# EAGLE board oresat-c3 (EAGLE 9.6.2), part 1 of 2
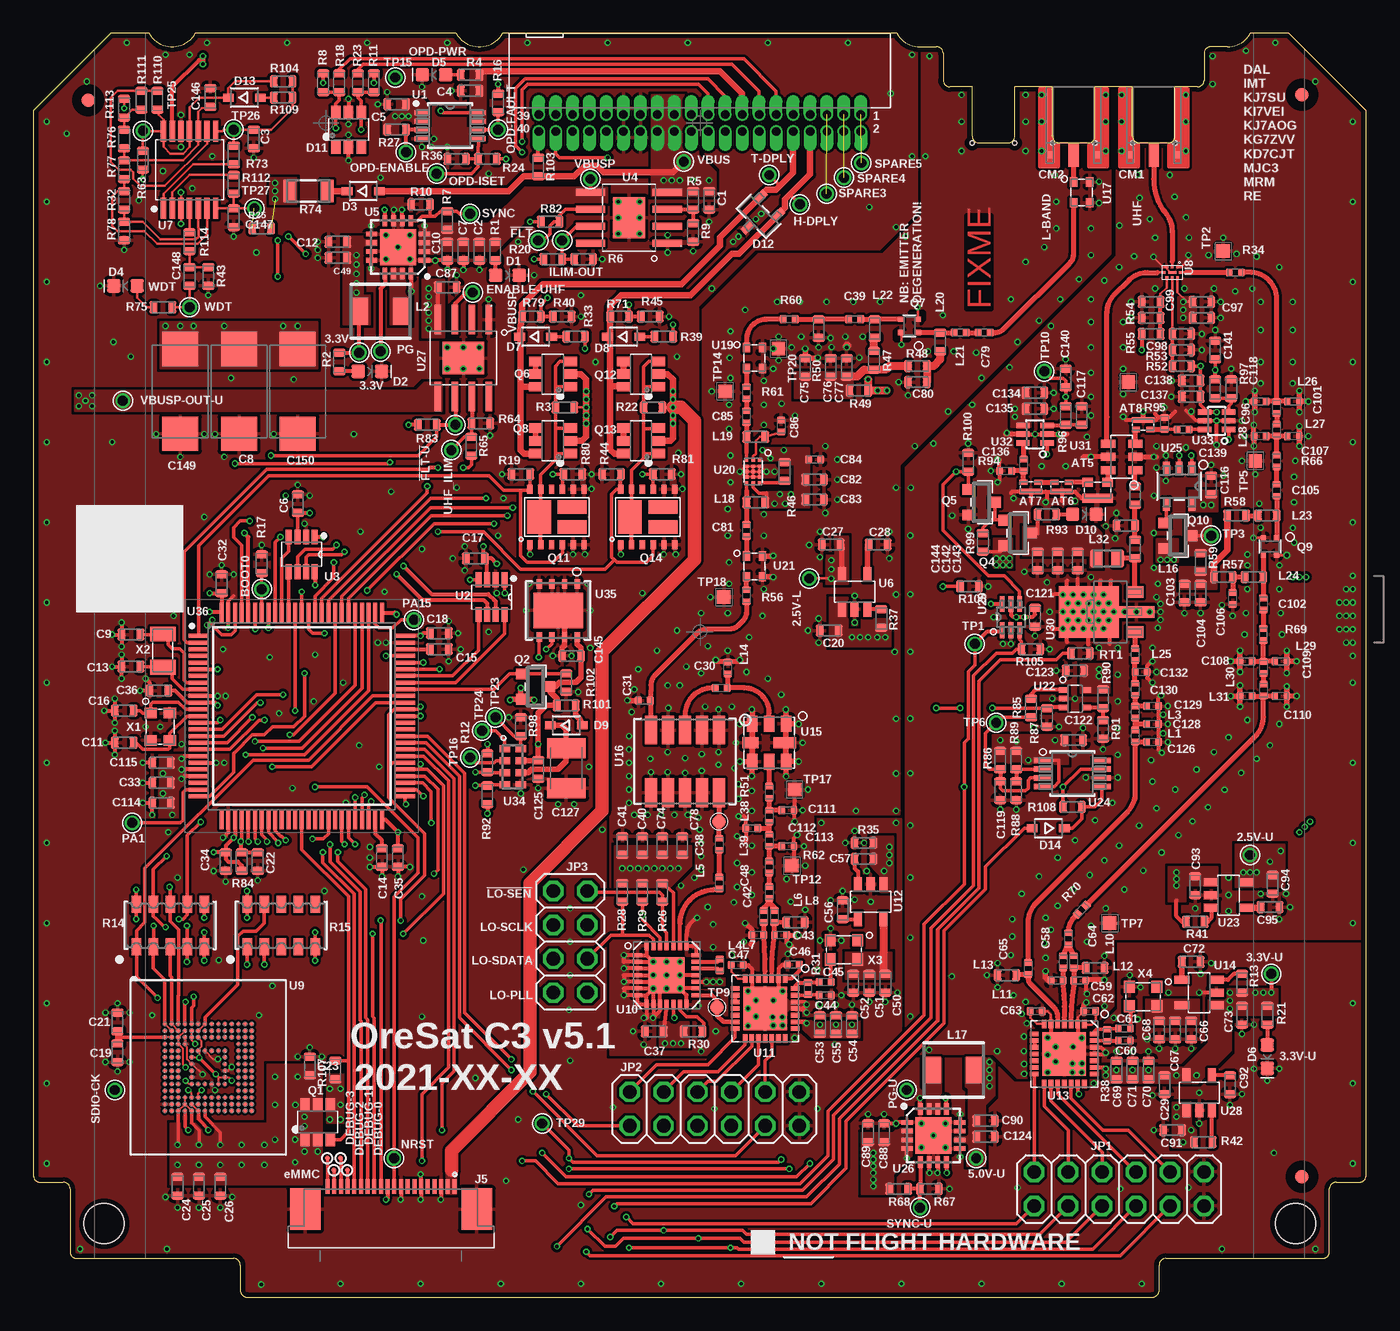
[diagram p9: board, top side]
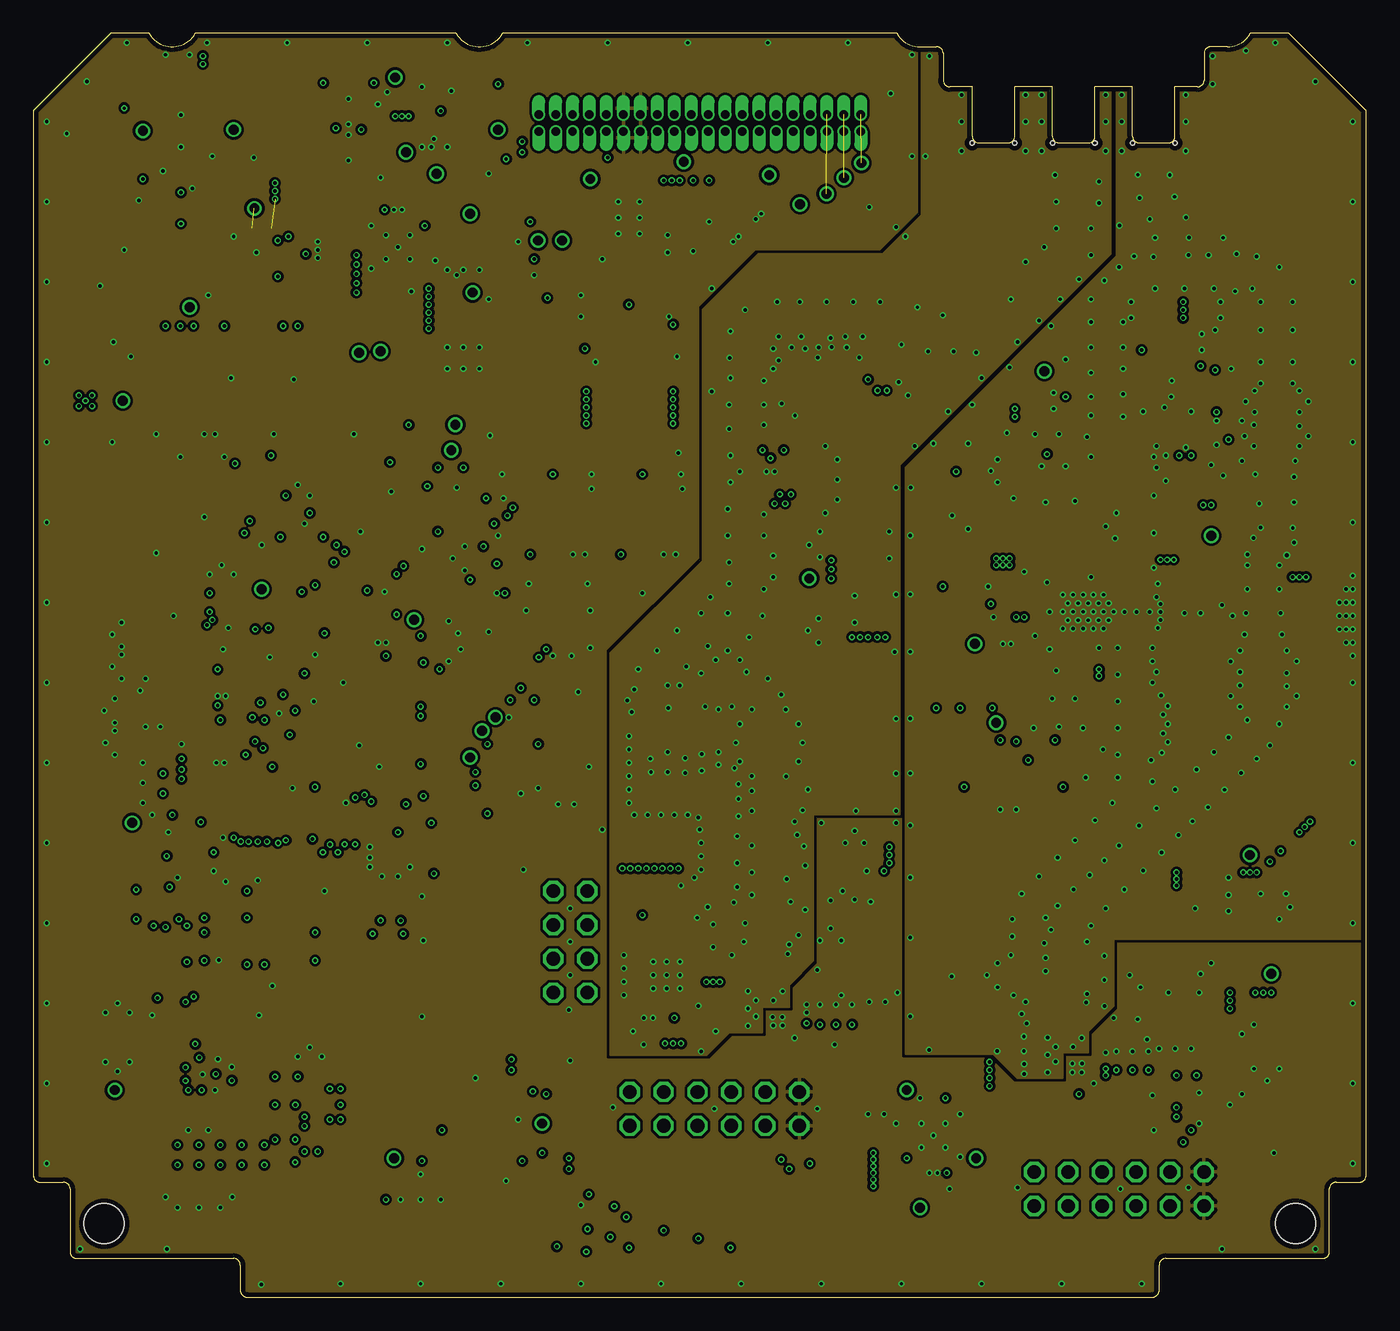
[diagram p10: board, inner layer GND]
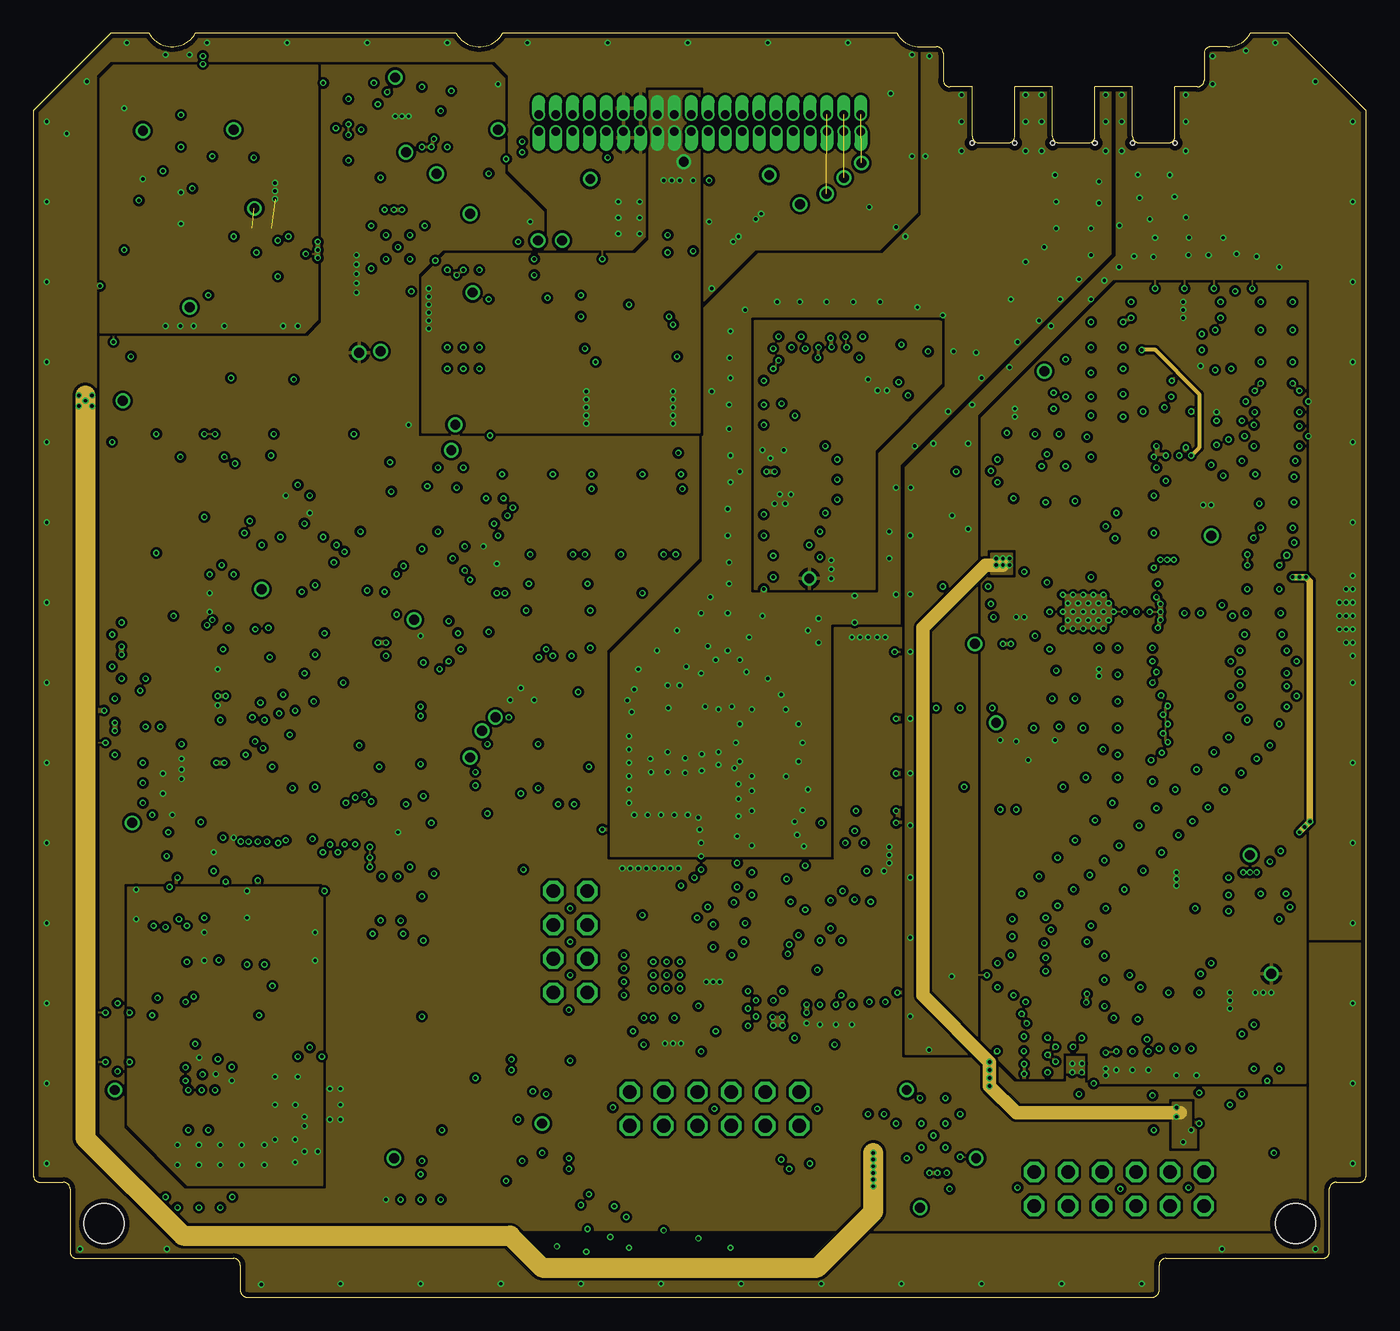
[diagram p11: board, inner layer VPLANE]
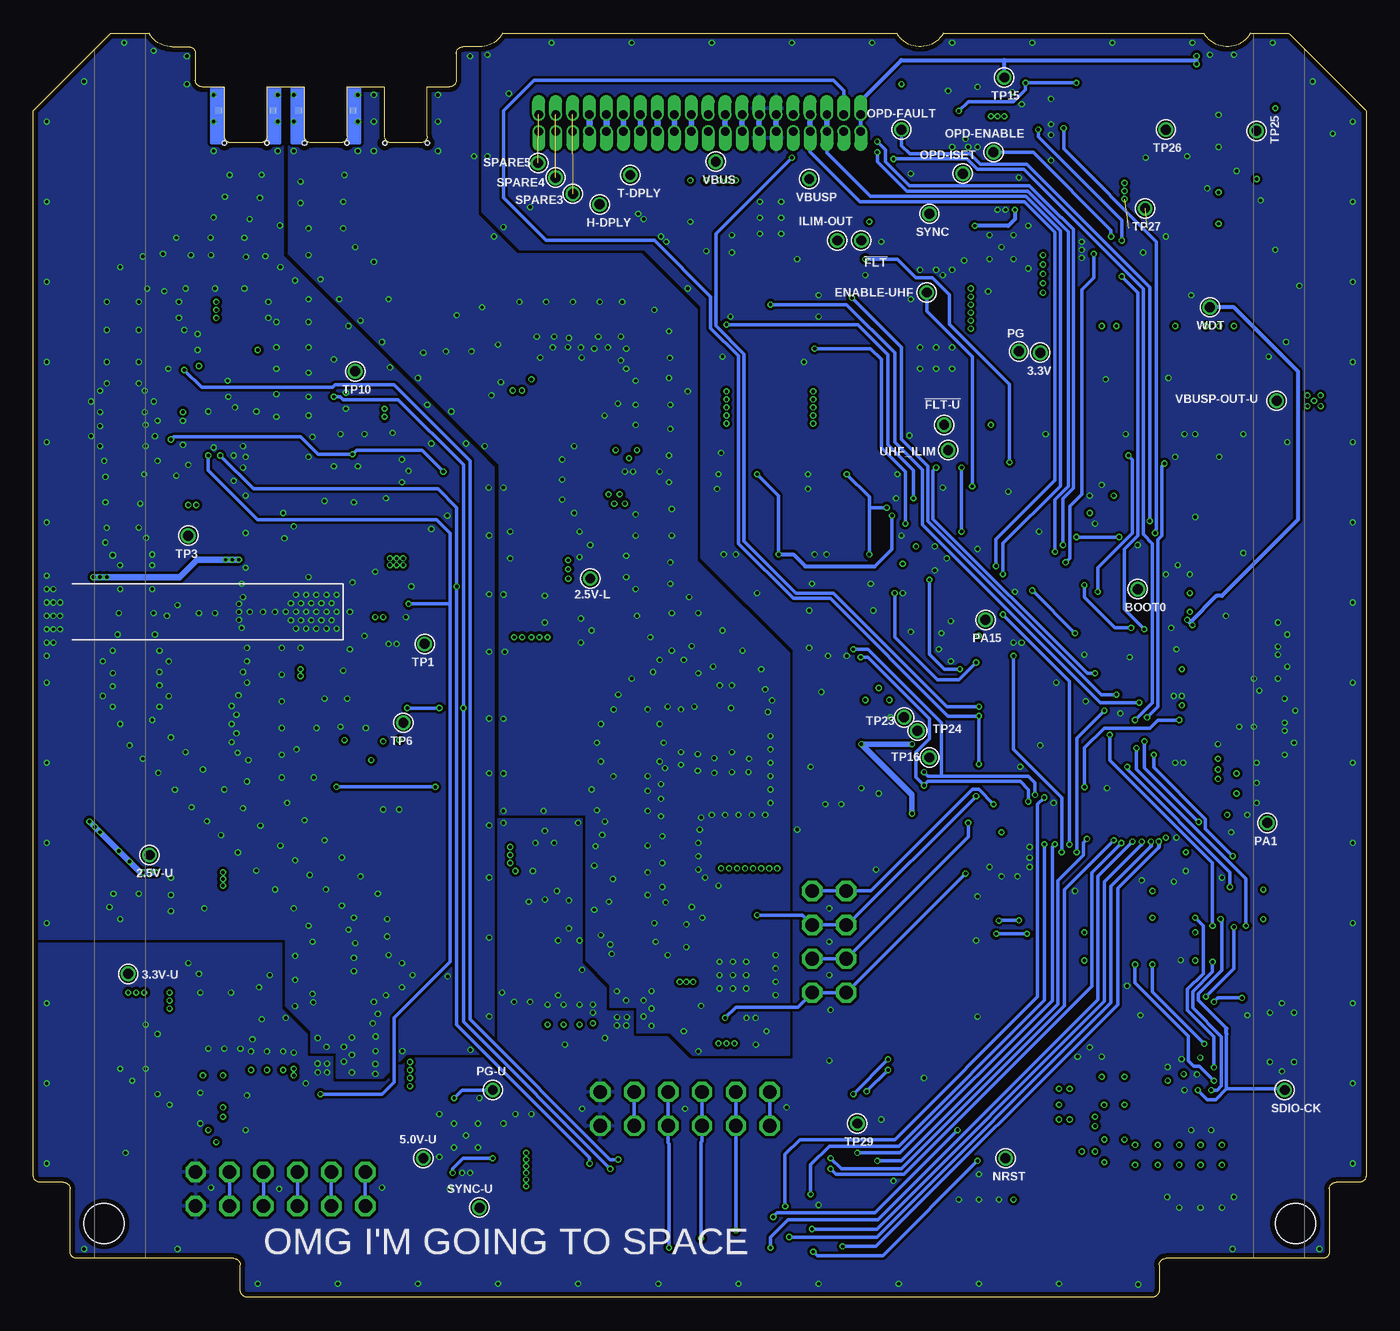
[diagram p12: board, bottom side, seen from below]

Size 99.8 x 94.6 mm. Coordinates in mm from the lower left corner, seen from the top.
Copper layers (1*2*15*16): Top 0.035559375mm / dielectric 0.17018125mm / GND 0.01778125mm / dielectric 47mil / VPLANE 0.01778125mm / dielectric 0.17018125mm / Bottom 0.035559375mm
Design rules "oshpark-4layer-tented": minimum track width 5mil, minimum drill 10mil, track to track 5mil, track to pad 5mil, pad to pad 5mil, via to via 5mil, smd to smd 5mil, copper to edge 15mil, drill to drill 6mil, minimum pad ring 4mil, minimum via ring 4mil, stop-mask expansion 2.5mil, vias tented up to drill 20mil, thermal gap 10mil
Net classes: 1 RF: clearance 0.75 mm
tRestrict: area 47.2,25.6 to 47.6,25.7; area 47.2,22.5 to 47.7,22.6; 4 lines

## Footprints (pad centres in the part's own frame; a part is rotated, then mirrored left to right if it is on the bottom)
1X01 = drill 0.737 pad 1.1: 1 0,0
0805 = smd 0.8 x 0.7: 1 -0.75,0.6; 2 0.75,0.6 | smd 2.3 x 0.7: 3 0,-0.6
0603 = smd 0.6 x 0.4: 1 -0.55,0.35; 2 0.55,0.35 | smd 1.7 x 0.4: 3 0,-0.35
.0603-C-NOSILK = smd 0.6 x 0.9: 1 -0.7,0; 2 0.7,0
D/7343-31R = smd 2.55 x 2.7: + 3.175,0; - -3.175,0
.0402-C-NOSILK = smd 0.5 x 0.6: 1 -0.45,0; 2 0.45,0
C1210K = smd 1.5 x 2.9: 1 -1.5,0; 2 1.5,0
J-MOLEX-SMPM-073300-003X = smd 0.508 x 0.508: P$1 -1.778,-5.08; P$2 1.778,-5.08 | smd 0.508 x 0.508 bottom: P$3 -2.032,-1.778; P$4 2.032,-1.778 | smd 0.762 x 1.778: RF 0,-5.08
LED-0603 = smd 1 x 1: A -0.877,0; C 0.877,0
SOD323-R = smd 0.8 x 0.6: A 1.2,0; C -1.2,0
SOT23-6 = smd 0.7 x 1: 1 0.95,1.3; 2 0,1.3; 3 -0.95,1.3; 4 -0.95,-1.3; 5 0,-1.3; 6 0.95,-1.3
DIO_MMBZ1_ROM = smd 0.568 x 0.903: 1 -0.95,-1.194; 2 0.95,-1.194; 3 0,1.194
TEST-POINT-SMALL = smd 0.381 x 0.381: TP 0,0
FIDUCIAL-1.0X2.0 = smd 1 x 1: FIDUCIAL 0,0
TE_2-1734592-0 = smd 0.3 x 1.1: 1 -4.75,-1.7; 2 -4.25,-1.7; 3 -3.75,-1.7; 4 -3.25,-1.7; 5 -2.75,-1.7; 6 -2.25,-1.7; 7 -1.75,-1.7; 8 -1.25,-1.7; 9 -0.75,-1.7; 10 -0.25,-1.7; 11 0.25,-1.7; 12 0.75,-1.7; 13 1.25,-1.7; 14 1.75,-1.7; 15 2.25,-1.7; 16 2.75,-1.7; 17 3.25,-1.7; 18 3.75,-1.7; 19 4.25,-1.7; 20 4.75,-1.7 | smd 2.3 x 3.1: PAD1 6.42,0; PAD2 -6.42,0
J-SAMTEC-TFM-120-X1-XXX-D-RA = drill 0.635 pad 0.965 offset: 1 12.065,0.635; 2 12.065,-0.635; 3 10.795,0.635; 4 10.795,-0.635; 5 9.525,0.635; 6 9.525,-0.635; 7 8.255,0.635; 8 8.255,-0.635; 9 6.985,0.635; 10 6.985,-0.635; 11 5.715,0.635; 12 5.715,-0.635; 13 4.445,0.635; 14 4.445,-0.635; 15 3.175,0.635; 16 3.175,-0.635; 17 1.905,0.635; 18 1.905,-0.635; 19 0.635,0.635; 20 0.635,-0.635; 21 -0.635,0.635; 22 -0.635,-0.635; 23 -1.905,0.635; 24 -1.905,-0.635; 25 -3.175,0.635; 26 -3.175,-0.635; 27 -4.445,0.635; 28 -4.445,-0.635; 29 -5.715,0.635; 30 -5.715,-0.635; 31 -6.985,0.635; 32 -6.985,-0.635; 33 -8.255,0.635; 34 -8.255,-0.635; 35 -9.525,0.635; 36 -9.525,-0.635; 37 -10.795,0.635; 38 -10.795,-0.635; 39 -12.065,0.635; 40 -12.065,-0.635
2X06 = drill 1.016 octagon: 1 -6.35,-1.27; 2 -6.35,1.27; 3 -3.81,-1.27; 4 -3.81,1.27; 5 -1.27,-1.27; 6 -1.27,1.27; 7 1.27,-1.27; 8 1.27,1.27; 9 3.81,-1.27; 10 3.81,1.27; 11 6.35,-1.27; 12 6.35,1.27
2X04 = drill 1.016 octagon: 1 -3.81,-1.27; 2 -3.81,1.27; 3 -1.27,-1.27; 4 -1.27,1.27; 5 1.27,-1.27; 6 1.27,1.27; 7 3.81,-1.27; 8 3.81,1.27
ECS-MPI4040 = smd 2 x 1.3: 1 0,1.575; 2 0,-1.575
.0805-C-NOSILK = smd 0.95 x 1.35: 1 -0.8,0; 2 0.8,0
ORESAT-CARD-V1.3-GENERIC-3RF = hole 0.32: 70.31,86.4; 73.49,86.4; 76.31,86.4; 79.49,86.4; 85.49,86.4; 82.31,86.4 | hole 3: 94.5,5.5; 5.3,5.5
SOT23-6' = smd 0.7 x 1: 1 -0.95,-1.3; 2 0,-1.3; 3 0.95,-1.3; 4 0.95,1.3; 5 0,1.3; 6 -0.95,1.3
SOT23-3 = smd 0.8 x 0.9: 1 -0.95,-1; 2 0.95,-1; 3 0,1
TSFP4 = smd 0.4 x 0.4: 1 -0.5,-0.65; 2 0.5,-0.65; 3 0.5,0.65; 4 -0.5,0.65
FDMQ8203 = smd 0.4 x 0.65: 1 -2.024,-2.075; 2 -1.212,-2.075; 3 -0.399,-2.075; 4 0.414,-2.075; 5 1.227,-2.075; 6 2.04,-2.075; 7 2.039,2.075; 8 1.227,2.075; 9 0.414,2.075; 10 -0.399,2.075; 11 -1.212,2.075; 12 -2.025,2.075 | smd 1.78 x 2.5: 13 -1.334,0 | smd 2.17 x 1: 14 1.14,-0.75; 15 1.141,0.753
ARRAY_EXBA-M = smd 1.27 x 0.711: 1 -1.575,2.54; 2 -1.575,1.27; 3 -1.575,0; 4 -1.575,-1.27; 5 -1.575,-2.54; 6 1.575,-2.54; 7 1.575,-1.27; 8 1.575,0; 9 1.575,1.27; 10 1.575,2.54
1206-C = smd 0.95 x 1.7: 1 -1.4,0; 2 1.4,0
TESTPOINT_SMD-10SN = smd 1 x 1: TP 0,0
TESTPOINT_SMD-CIRCLE-1MM = smd 1 x 1: TP 0,0
21-0036K-L = smd 1.06 x 0.376: 1 -2.134,0.975; 2 -2.134,0.325; 3 -2.134,-0.325; 4 -2.134,-0.975; 5 2.134,-0.975; 6 2.134,-0.325; 7 2.134,0.325; 8 2.134,0.975
SOT23-8_TI-DCN = smd 0.45 x 1.1: 1 -0.975,-1.3; 2 -0.325,-1.3; 3 0.325,-1.3; 4 0.975,-1.3; 5 0.975,1.3; 6 0.325,1.3; 7 -0.325,1.3; 8 -0.975,1.3
SO-POWERPAD-8 = smd 0.5 x 2.2: 1 -1.905,-2.875; 2 -0.635,-2.875; 3 0.635,-2.875; 4 1.905,-2.875; 5 1.905,2.875; 6 0.635,2.875; 7 -0.635,2.875; 8 -1.905,2.875 | smd 3.1 x 2.4: THERMAL 0,0
S-PVQFN-16 = smd 0.85 x 0.35: 1 -1.975,0.975; 2 -1.975,0.325; 3 -1.975,-0.325; 4 -1.975,-0.975; 9 1.975,-0.975; 10 1.975,-0.325; 11 1.975,0.325; 12 1.975,0.975 | smd 0.35 x 0.85: 5 -0.975,-1.975; 6 -0.325,-1.975; 7 0.325,-1.975; 8 0.975,-1.975; 13 0.975,1.975; 14 0.325,1.975; 15 -0.325,1.975; 16 -0.975,1.975 | smd 2.7 x 2.7: PAD 0,0
SOT-23 = smd 1.1 x 0.6: 1 -1.3,0.95; 2 -1.3,0; 3 -1.3,-0.95; 4 1.3,-0.95; 5 1.3,0.95
SOP65P640X120-14N = smd 1.572 x 0.407: 1 -2.872,1.95; 2 -2.872,1.3; 3 -2.872,0.65; 4 -2.872,0; 5 -2.872,-0.65; 6 -2.872,-1.3; 7 -2.872,-1.95; 8 2.872,-1.95; 9 2.872,-1.3; 10 2.872,-0.65; 11 2.872,0; 12 2.872,0.65; 13 2.872,1.3; 14 2.872,1.95
QPC1022 = smd 0.2 x 0.2: 1 -0.4,0.4; 2 -0.4,0; 3 -0.4,-0.4; 4 0,-0.6; 5 0.4,-0.4; 6 0.4,0; 7 0.4,0.4; 8 0,0.6 | smd 0.2 x 0.6: 9 0,0
BGA-153(11.5X13)(EMMC-BA) = smd 0.28 x 0.28: A1 -3.25,3.25; A2 -2.75,3.25; A3 -2.25,3.25; A4 -1.75,3.25; A5 -1.25,3.25; A6 -0.75,3.25; A7 -0.25,3.25; A8 0.25,3.25; A9 0.75,3.25; A10 1.25,3.25; A11 1.75,3.25; A12 2.25,3.25; A13 2.75,3.25; A14 3.25,3.25; B1 -3.25,2.75; B2 -2.75,2.75; B3 -2.25,2.75; B4 -1.75,2.75; B5 -1.25,2.75; B6 -0.75,2.75; B7 -0.25,2.75; B8 0.25,2.75; B9 0.75,2.75; B10 1.25,2.75; B11 1.75,2.75; B12 2.25,2.75; B13 2.75,2.75; B14 3.25,2.75; C1 -3.25,2.25; C2 -2.75,2.25; C3 -2.25,2.25; C4 -1.75,2.25; C5 -1.25,2.25; C6 -0.75,2.25; C7 -0.25,2.25; C8 0.25,2.25; C9 0.75,2.25; C10 1.25,2.25; C11 1.75,2.25; C12 2.25,2.25; C13 2.75,2.25; C14 3.25,2.25; D1 -3.25,1.75; D2 -2.75,1.75; D3 -2.25,1.75; D4 -1.75,1.75; D12 2.25,1.75; D13 2.75,1.75; D14 3.25,1.75; E1 -3.25,1.25; E2 -2.75,1.25; E3 -2.25,1.25; E5 -1.25,1.25; E6 -0.75,1.25; E7 -0.25,1.25; E8 0.25,1.25; E9 0.75,1.25; E10 1.25,1.25; E12 2.25,1.25; E13 2.75,1.25; E14 3.25,1.25; F1 -3.25,0.75; F2 -2.75,0.75; F3 -2.25,0.75; F5 -1.25,0.75; F10 1.25,0.75; F12 2.25,0.75; F13 2.75,0.75; F14 3.25,0.75; G1 -3.25,0.25; G2 -2.75,0.25; G3 -2.25,0.25; G5 -1.25,0.25; G10 1.25,0.25; G12 2.25,0.25; G13 2.75,0.25; G14 3.25,0.25; H1 -3.25,-0.25; H2 -2.75,-0.25; H3 -2.25,-0.25; H5 -1.25,-0.25; H10 1.25,-0.25; H12 2.25,-0.25; H13 2.75,-0.25; H14 3.25,-0.25; J1 -3.25,-0.75; J2 -2.75,-0.75; J3 -2.25,-0.75; J5 -1.25,-0.75; J10 1.25,-0.75; J12 2.25,-0.75; J13 2.75,-0.75; J14 3.25,-0.75; K1 -3.25,-1.25; K2 -2.75,-1.25; K3 -2.25,-1.25; K5 -1.25,-1.25; K6 -0.75,-1.25; K7 -0.25,-1.25; K8 0.25,-1.25; K9 0.75,-1.25; K10 1.25,-1.25; K12 2.25,-1.25; K13 2.75,-1.25; K14 3.25,-1.25; L1 -3.25,-1.75; L2 -2.75,-1.75; L3 -2.25,-1.75; L12 2.25,-1.75; L13 2.75,-1.75; L14 3.25,-1.75; M1 -3.25,-2.25; M2 -2.75,-2.25; M3 -2.25,-2.25; M4 -1.75,-2.25; M5 -1.25,-2.25; M6 -0.75,-2.25; M7 -0.25,-2.25; M8 0.25,-2.25; M9 0.75,-2.25; M10 1.25,-2.25; M11 1.75,-2.25; M12 2.25,-2.25; M13 2.75,-2.25; M14 3.25,-2.25; N1 -3.25,-2.75; N2 -2.75,-2.75; N3 -2.25,-2.75; N4 -1.75,-2.75; N5 -1.25,-2.75; N6 -0.75,-2.75; N7 -0.25,-2.75; N8 0.25,-2.75; N9 0.75,-2.75; N10 1.25,-2.75; N11 1.75,-2.75; N12 2.25,-2.75; N13 2.75,-2.75; N14 3.25,-2.75; P1 -3.25,-3.25; P2 -2.75,-3.25; P3 -2.25,-3.25; P4 -1.75,-3.25; P5 -1.25,-3.25; P6 -0.75,-3.25; P7 -0.25,-3.25; P8 0.25,-3.25; P9 0.75,-3.25; P10 1.25,-3.25; P11 1.75,-3.25; P12 2.25,-3.25; P13 2.75,-3.25; P14 3.25,-3.25
QFN28-5X5-WITH-CENTER-PAD = smd 0.7 x 0.3: 1 -2.2,1.5; 2 -2.2,1; 3 -2.2,0.5; 4 -2.2,0; 5 -2.2,-0.5; 6 -2.2,-1; 7 -2.2,-1.5; 15 2.2,-1.5; 16 2.2,-1; 17 2.2,-0.5; 18 2.2,0; 19 2.2,0.5; 20 2.2,1; 21 2.2,1.5 | smd 0.3 x 0.7: 8 -1.5,-2.2; 9 -1,-2.2; 10 -0.5,-2.2; 11 0,-2.2; 12 0.5,-2.2; 13 1,-2.2; 14 1.5,-2.2; 22 1.5,2.2; 23 1,2.2; 24 0.5,2.2; 25 0,2.2; 26 -0.5,2.2; 27 -1,2.2; 28 -1.5,2.2 | smd 2.7 x 2.7: PAD 0,0
QFN28-5X5-WITH-CENTER-PAD' = smd 0.65 x 0.35: 1 -2.25,1.5; 2 -2.25,1; 3 -2.25,0.5; 4 -2.25,0; 5 -2.25,-0.5; 6 -2.25,-1; 7 -2.25,-1.5; 15 2.25,-1.5; 16 2.25,-1; 17 2.25,-0.5; 18 2.25,0; 19 2.25,0.5; 20 2.25,1; 21 2.25,1.5 | smd 0.35 x 0.65: 8 -1.5,-2.25; 9 -1,-2.25; 10 -0.5,-2.25; 11 0,-2.25; 12 0.5,-2.25; 13 1,-2.25; 14 1.5,-2.25; 22 1.5,2.25; 23 1,2.25; 24 0.5,2.25; 25 0,2.25; 26 -0.5,2.25; 27 -1,2.25; 28 -1.5,2.25 | smd 3.25 x 3.25: PAD 0,0
3.8X3.8 = smd 1.19 x 0.81: 1 -1.41,1.27; 2 -1.41,0; 3 -1.41,-1.27; 5 1.41,-1.27; 6 1.41,0; 7 1.41,1.27 | smd 0.81 x 1.19: 4 0,-1.41 | smd 0.81 x 1.7: 8 0,1.155
MAC-24+ = smd 0.89 x 2.16: 1 -2.54,-2.35; 2 -1.27,-2.35; 3 0,-2.35; 4 1.27,-2.35; 5 2.54,-2.35; 6 2.54,2.35; 7 1.27,2.35; 8 0,2.35; 9 -1.27,2.35; 10 -2.54,2.35
BP0805 = smd 0.54 x 0.7: 1 -0.6,0.775; 2 -0.6,-0.775; 3 0.6,-0.775; 4 0.6,0.775
BGB7XXL7ESD = smd 0.25 x 0.25: 1 -0.5,-0.85; 2 0,-0.85; 3 0.5,-0.85; 4 0.5,0.85; 5 0,0.85; 6 -0.5,0.85; 7 0.48,-0.4; 8 0,-0.4; 9 -0.48,-0.4; 10 0.48,0; 11 0,0; 12 -0.48,0; 13 0.48,0.4; 14 0,0.4; 15 -0.48,0.4
SC70-5 = smd 0.4 x 0.7: 1 -0.65,-0.85; 2 0,-0.85; 3 0.65,-0.85; 4 0.65,0.85; 5 -0.65,0.85
21-0036K_MXM = smd 1.321 x 0.406: 1 -2.21,0.975; 2 -2.21,0.325; 3 -2.21,-0.325; 4 -2.21,-0.975; 5 2.21,-0.975; 6 2.21,-0.325; 7 2.21,0.325; 8 2.21,0.975
DBV5 = smd 0.972 x 0.508: 1 -1.362,0.95; 2 -1.362,0; 3 -1.362,-0.95; 4 1.362,-0.95; 5 1.362,0.95
DCK6 = smd 1.168 x 0.356: 1 -0.978,0.65; 2 -0.978,0; 3 -0.978,-0.65; 4 0.978,-0.65; 5 0.978,0; 6 0.978,0.65
U-QORVO-TQP7M9105-PA_TQP7M9105 = smd 0.86 x 1.27: 1 -1.5,0.11; 3 1.5,0.11 | smd 0.86 x 2.65: 2 0,0 | smd 3.86 x 4.5: PAD 0,3.575
BDCN-20-13+ = smd 0.61 x 1.07: 1 -0.99,-1.025; 2 0,-1.025; 3 0.99,-1.025; 4 0.99,1.025; 5 0,1.025; 6 -0.99,1.025
SC70 = smd 0.4 x 1: 1 -0.65,-0.9; 2 0,-0.9; 3 0.65,-0.9; 4 0.65,0.9; 5 0,0.9; 6 -0.65,0.9
RV3028C732768KHZ1PPMTAQC = smd 0.5 x 0.8: 1 -1.35,-0.6; 2 -0.45,-0.6; 3 0.45,-0.6; 4 1.35,-0.6; 5 1.35,0.6; 6 0.45,0.6; 7 -0.45,0.6; 8 -1.35,0.6
TDFN-8 = smd 0.706 x 0.407: 1 -1.992,1.425; 2 -1.992,0.475; 3 -1.992,-0.475; 4 -1.992,-1.425; 5 1.992,-1.425; 6 1.992,-0.475; 7 1.992,0.475; 8 1.992,1.425 | smd 2.692 x 3.708: 9 0,0
QFP50P1600X1600X160-100N = smd 1.475 x 0.3: 1 -7.738,6; 2 -7.738,5.5; 3 -7.738,5; 4 -7.738,4.5; 5 -7.738,4; 6 -7.738,3.5; 7 -7.738,3; 8 -7.738,2.5; 9 -7.738,2; 10 -7.738,1.5; 11 -7.738,1; 12 -7.738,0.5; 13 -7.738,0; 14 -7.738,-0.5; 15 -7.738,-1; 16 -7.738,-1.5; 17 -7.738,-2; 18 -7.738,-2.5; 19 -7.738,-3; 20 -7.738,-3.5; 21 -7.738,-4; 22 -7.738,-4.5; 23 -7.738,-5; 24 -7.738,-5.5; 25 -7.738,-6; 51 7.738,-6; 52 7.738,-5.5; 53 7.738,-5; 54 7.738,-4.5; 55 7.738,-4; 56 7.738,-3.5; 57 7.738,-3; 58 7.738,-2.5; 59 7.738,-2; 60 7.738,-1.5; 61 7.738,-1; 62 7.738,-0.5; 63 7.738,0; 64 7.738,0.5; 65 7.738,1; 66 7.738,1.5; 67 7.738,2; 68 7.738,2.5; 69 7.738,3; 70 7.738,3.5; 71 7.738,4; 72 7.738,4.5; 73 7.738,5; 74 7.738,5.5; 75 7.738,6 | smd 0.3 x 1.475: 26 -6,-7.738; 27 -5.5,-7.738; 28 -5,-7.738; 29 -4.5,-7.738; 30 -4,-7.738; 31 -3.5,-7.738; 32 -3,-7.738; 33 -2.5,-7.738; 34 -2,-7.738; 35 -1.5,-7.738; 36 -1,-7.738; 37 -0.5,-7.738; 38 0,-7.738; 39 0.5,-7.738; 40 1,-7.738; 41 1.5,-7.738; 42 2,-7.738; 43 2.5,-7.738; 44 3,-7.738; 45 3.5,-7.738; 46 4,-7.738; 47 4.5,-7.738; 48 5,-7.738; 49 5.5,-7.738; 50 6,-7.738; 76 6,7.738; 77 5.5,7.738; 78 5,7.738; 79 4.5,7.738; 80 4,7.738; 81 3.5,7.738; 82 3,7.738; 83 2.5,7.738; 84 2,7.738; 85 1.5,7.738; 86 1,7.738; 87 0.5,7.738; 88 0,7.738; 89 -0.5,7.738; 90 -1,7.738; 91 -1.5,7.738; 92 -2,7.738; 93 -2.5,7.738; 94 -3,7.738; 95 -3.5,7.738; 96 -4,7.738; 97 -4.5,7.738; 98 -5,7.738; 99 -5.5,7.738; 100 -6,7.738
2.5X2.0 = smd 0.8 x 0.9: 1 -1.025,-0.725; 2 1.025,-0.725; 3 1.025,0.725; 4 -1.025,0.725
ABS07-32.768KHZ-T = smd 1.1 x 1.9: 1 -1.25,0; 2 1.25,0

## Placement (x,y rotation side)
2.5V-L  TEST-POINT-LARGE  [1X01]  58.1,53.8 90 top
2.5V-U  TEST-POINT-LARGE  [1X01]  91.1,33.1 0 top
3.3V  TEST-POINT-LARGE  [1X01]  24.4,70.7 0 top
3.3V-U  TEST-POINT-LARGE  [1X01]  92.7,24.2 0 top
5.0V-U  TEST-POINT-LARGE  [1X01]  70.6,10.4 180 top
!FLT  TEST-POINT-LARGE  [1X01]  37.8,79.1 0 top
!FLT-U  TEST-POINT-LARGE  [1X01]  31.6,65.3 90 top
AT5  10dB  [0805]  79.7,60.4 0 top
AT6  10dB  [0603]  77,60.65 0 top
AT7  10dB  [0603]  74.7,60.65 0 top
AT8  10dB  [0603]  83.1,65.3 180 top
BOOT0  TEST-POINT-LARGE  [1X01]  17.1,53 0 top
C1  1u  [.0603-C-NOSILK]  50.6,82.1 270 top
C2  10u  [.0603-C-NOSILK]  33.4,78.3 270 top
C3  10u  [.0603-C-NOSILK]  16.5,86.7 270 top
C4  1u  [.0603-C-NOSILK]  32.7,90.3 180 top
C5  1u  [.0603-C-NOSILK]  27.2,89.3 180 top
C6  0.1u  [.0603-C-NOSILK]  19.8,59.4 270 top
C7  10u  [.0603-C-NOSILK]  32.2,78.3 270 top
C8  220u  [D/7343-31R]  15.4,67.8 90 top
C9  8.2p  [.0603-C-NOSILK]  7.3,49.6 180 top
C10  1u  [.0603-C-NOSILK]  31,78.3 270 top
C11  20p  [.0603-C-NOSILK]  6.8,41.5 180 top
C12  22u  [.0603-C-NOSILK]  22.8,79 180 top
C13  8.2p  [.0603-C-NOSILK]  7.3,47.2 180 top
C14  2.2u  [.0603-C-NOSILK]  26.1,32.9 270 top
C15  2.2u  [.0603-C-NOSILK]  30.4,48.5 0 top
C16  20p  [.0603-C-NOSILK]  6.8,43.9 180 top
C17  0.1u  [.0603-C-NOSILK]  33.1,55.3 0 top
C18  0.1u  [.0603-C-NOSILK]  30.4,49.7 0 top
C19  2.2u  [.0603-C-NOSILK]  6.3,18.3 270 top
C20  1u  [.0603-C-NOSILK]  59.6,49.9 0 top
C21  0.1u  [.0603-C-NOSILK]  6.3,20.6 90 top
C22  0.1u  [.0603-C-NOSILK]  16.8,32.6 270 top
C23  1u  [.0603-C-NOSILK]  20.7,17.3 90 top
C24  1u  [.0603-C-NOSILK]  10.8,8.3 270 top
C25  1u  [.0603-C-NOSILK]  12.4,8.3 270 top
C26  10u  [.0603-C-NOSILK]  14,8.3 270 top
C27  22u  [.0603-C-NOSILK]  59.74,56.34 180 top
C28  1u  [.0603-C-NOSILK]  63.26,56.33 0 top
C29  22u  [.0603-C-NOSILK]  84.7,15.9 270 top
C30  22p  [.0402-C-NOSILK]  51.5,45.6 0 top
C31  3p  [.0402-C-NOSILK]  45.75,44.65 359.8 top
C32  0.1u  [.0603-C-NOSILK]  14.1,53.4 90 top
C33  0.1u  [.0603-C-NOSILK]  9.6,38.5 180 top
C34  0.1u  [.0603-C-NOSILK]  14.4,32.6 270 top
C35  0.1u  [.0603-C-NOSILK]  27.3,32.9 270 top
C36  0.1u  [.0603-C-NOSILK]  9.4,45.4 180 top
C37  22n  [.0603-C-NOSILK]  46.5,19.9 180 top
C38  560p  [.0402-C-NOSILK]  51.35,33.9 90 top
C39  22p  [.0402-C-NOSILK]  61.5,73.2 180 top
C40  NP  [.0603-C-NOSILK]  45.6,33.8 90 top
C41  22n  [.0603-C-NOSILK]  44.1,33.8 90 top
C42  8.2p  [.0402-C-NOSILK]  54.7,28.5 270 top
C43  8.2p  [.0402-C-NOSILK]  55.95,27.1 180 top
C44  1n  [.0402-C-NOSILK]  59.3,22.6 0 top
C45  1n  [.0402-C-NOSILK]  59.3,23.6 0 top
C46  82p  [.0402-C-NOSILK]  56.9,24.9 180 top
C47  82p  [.0402-C-NOSILK]  52.71,24.86 180 top
C48  22p  [.0402-C-NOSILK]  55.1,30.3 270 top
C49  10u  [.0603-C-NOSILK]  22.8,77.8 180 top
C50  22n  [.0603-C-NOSILK]  63.8,23.5 270 top
C51  NP  [.0603-C-NOSILK]  62.6,23.5 270 top
C52  4.7u  [.0603-C-NOSILK]  61.4,23.5 270 top
C53  22n  [.0603-C-NOSILK]  58.9,20.4 90 top
C54  NP  [.0603-C-NOSILK]  61.3,20.4 90 top
C55  4.7u  [.0603-C-NOSILK]  60.1,20.4 90 top
C56  10n  [.0603-C-NOSILK]  60.6,29 90 top
C57  1u  [.0603-C-NOSILK]  62.2,34 180 top
C58  8.2p  [.0402-C-NOSILK]  77.1,25.1 270 top
C59  8.2p  [.0402-C-NOSILK]  78.35,23.7 180 top
C60  1n  [.0402-C-NOSILK]  81.7,19.2 0 top
C61  1n  [.0402-C-NOSILK]  81.7,20.1 0 top
C62  82p  [.0402-C-NOSILK]  79.1,21.4 180 top
C63  82p  [.0402-C-NOSILK]  75.1,21.4 180 top
C64  22p  [.0402-C-NOSILK]  77.5,26.83 270 top
C65  22p  [.0402-C-NOSILK]  74.5,24.6 270 top
C66  22n  [.0603-C-NOSILK]  86.7,20 270 top
C67  NP  [.0603-C-NOSILK]  85.5,20 270 top
C68  4.7u  [.0603-C-NOSILK]  84.3,20 270 top
C69  22n  [.0603-C-NOSILK]  81.1,17 90 top
C70  NP  [.0603-C-NOSILK]  83.5,17 90 top
C71  4.7u  [.0603-C-NOSILK]  82.3,17 90 top
C72  10n  [.0603-C-NOSILK]  86.7,25.1 0 top
C73  1u  [.0603-C-NOSILK]  90.5,21.1 270 top
C74  NP  [.0603-C-NOSILK]  47.1,33.8 90 top
C75  1u  [.0603-C-NOSILK]  57.8,69.6 90 top
C76  47n  [.0603-C-NOSILK]  59.7,69.6 90 top
C77  NP  [.0603-C-NOSILK]  60.9,69.6 90 top
C78  1u  [.0603-C-NOSILK]  48.6,33.8 90 top
C79  22p  [.0402-C-NOSILK]  71.2,72.2 180 top
C80  47n  [.0603-C-NOSILK]  66.2,68.5 180 top
C81  22p  [.0402-C-NOSILK]  53.4,57.4 270 top
C82  1u  [.0603-C-NOSILK]  58.5,61.2 0 top
C83  NP  [.0603-C-NOSILK]  58.5,59.7 0 top
C84  47n  [.0402-C-NOSILK]  58.5,62.7 0 top
C85  22p  [.0402-C-NOSILK]  53.4,65.9 270 top
C86  47n  [.0402-C-NOSILK]  56,65.2 90 top
C87  1u  [.0603-C-NOSILK]  31,75.6 180 top
C88  10u  [.0603-C-NOSILK]  63.7,12.3 90 top
C89  1u  [.0603-C-NOSILK]  62.5,12.3 90 top
C90  22u  [.0603-C-NOSILK]  71.3,13.2 0 top
C91  1u  [.0603-C-NOSILK]  85.3,12.5 180 top
C92  1u  [.0603-C-NOSILK]  89.6,15.9 270 top
C93  1u  [.0603-C-NOSILK]  87,30.8 90 top
C94  22u  [.0603-C-NOSILK]  92.8,30.9 270 top
C95  1u  [.0603-C-NOSILK]  92.6,29.2 0 top
C96  24p  [.0402-C-NOSILK]  91.85,67.05 180 top
C97  0.1u  [.0603-C-NOSILK]  87.5,74.5 0 top
C98  100p  [.0603-C-NOSILK]  86,72.1 0 top
C99  100p  [.0603-C-NOSILK]  83.7,74.5 180 top
C100  1u  [.0603-C-NOSILK]  87.5,73.3 0 top
C101  2.0p  [.0402-C-NOSILK]  93.1,66.6 270 top
C102  100p  [.0402-C-NOSILK]  92.11,51.89 270 top
C103  1u  [.0603-C-NOSILK]  86.2,52.7 270 top
C104  47n  [.0603-C-NOSILK]  87.4,52.7 270 top
C105  100p  [.0402-C-NOSILK]  93.1,60.4 270 top
C106  560p  [.0402-C-NOSILK]  89.8,52.3 270 top
C107  24p  [.0402-C-NOSILK]  94.35,64.45 0 top
C108  24p  [.0402-C-NOSILK]  90.81,47.59 180 top
C109  2.0p  [.0402-C-NOSILK]  92.11,47.14 270 top
C110  24p  [.0402-C-NOSILK]  93.41,44.99 0 top
C111  18p  [.0402-C-NOSILK]  56.5,36.45 0 top
C112  12p  [.0402-C-NOSILK]  53.8,35.1 180 top
C113  18p  [.0402-C-NOSILK]  56.5,33.75 0 top
C114  0.1u  [.0603-C-NOSILK]  9.6,37 180 top
C115  0.1u  [.0603-C-NOSILK]  9.6,40 180 top
C116  0.1u  [.0603-C-NOSILK]  88.2,60.8 90 top
C117  8.2p  [.0603-C-NOSILK]  78.5,66 90 top
C118  8.2p  [.0603-C-NOSILK]  89.7,68 90 top
C119  22u  [.0603-C-NOSILK]  72.4,37.9 270 top
C121  0.1u  [.0603-C-NOSILK]  75,50.9 270 top
C122  0.1u  [.0603-C-NOSILK]  77.9,41.7 0 top
C123  0.1u  [.0603-C-NOSILK]  78,46.9 180 top
C124  0.1u  [.0603-C-NOSILK]  71.3,12 0 top
C125  0.1u  [.0603-C-NOSILK]  37.8,39.5 270 top
C126  18p  [.0402-C-NOSILK]  83.8,41.55 0 top
C127  100u  [C1210K]  39.9,39.6 270 top
C128  12p  [.0402-C-NOSILK]  83.8,42.9 0 top
C129  18p  [.0402-C-NOSILK]  83.8,44.25 0 top
C130  100p  [.0402-C-NOSILK]  82.5,45.5 90 top
C131  100p  [.0603-C-NOSILK]  82.5,60 90 top
C132  27p  [.0402-C-NOSILK]  82.95,46.8 0 top
C133  10p  [.0603-C-NOSILK]  81.8,57.75 180 top
C134  0.1u  [.0603-C-NOSILK]  75,67.7 0 top
C135  100p  [.0603-C-NOSILK]  75,66.5 0 top
C136  1n  [.0402-C-NOSILK]  74.15,62.3 270 top
C137  0.1u  [.0603-C-NOSILK]  86.7,67.4 180 top
C138  100p  [.0603-C-NOSILK]  86.7,68.6 180 top
C139  1n  [.0402-C-NOSILK]  86.1,64.95 180 top
C140  NP  [.0603-C-NOSILK]  77.3,68.8 90 top
C141  NP  [.0603-C-NOSILK]  88.5,70.9 90 top
C142  1u  [.0603-C-NOSILK]  76.7,55.1 270 top
C143  47n  [.0603-C-NOSILK]  78.2,55.1 270 top
C144  NP  [.0603-C-NOSILK]  75.2,55.1 270 top
C145  0.1u  [.0603-C-NOSILK]  40.3,48 180 top
C146  10u  [.0603-C-NOSILK]  13.25,89.8 90 top
C147  10u  [.0603-C-NOSILK]  15,80.8 270 top
C148  10u  [.0603-C-NOSILK]  11.7,76.4 90 top
C149  220u  [D/7343-31R]  11,67.8 90 top
C150  220u  [D/7343-31R]  19.8,67.8 90 top
CM1  J-MOLEX-SMPM-73300-003X  [J-MOLEX-SMPM-073300-003X]  83.9,90.6 0 top
CM2  J-MOLEX-SMPM-73300-003X  [J-MOLEX-SMPM-073300-003X]  77.9,90.6 0 top
D1  GREEN  [LED-0603]  35.5,76.5 0 top
D2  GREEN  [LED-0603]  25.2,69.3 0 top
D3  1N4151WS  [SOD323-R]  24.7,82.8 0 top
D4  GREEN  [LED-0603]  6.9,75.7 180 top
D5  GREEN  [LED-0603]  30,91.5 180 top
D6  GREEN  [LED-0603]  92.4,18 270 top
D7  1N4151WS  [SOD323-R]  37.6,71.9 0 top
D8  1N4151WS  [SOD323-R]  44.2,71.9 0 top
D9  1N4151WS  [SOD323-R]  39.9,42.8 0 top
D10  GREEN  [LED-0603]  78.7,58.6 0 top
D11  SN65220  [SOT23-6]  23.6,87.4 180 top
D12  MMBZ15VALFHT116  [DIO_MMBZ1_ROM]  54.3,80.9 135 top
D13  1N4151WS  [SOD323-R]  15.8,89.8 0 top
D14  1N4151WS  [SOD323-R]  76,35.1 180 top
DEBUG-0  TEST-POINT-SMALL  [TEST-POINT-SMALL]  23.5,9.5 0 top
DEBUG-1  TEST-POINT-SMALL  [TEST-POINT-SMALL]  23,10.4 0 top
DEBUG-2  TEST-POINT-SMALL  [TEST-POINT-SMALL]  22.5,9.5 0 top
DEBUG-3  TEST-POINT-SMALL  [TEST-POINT-SMALL]  22,10.4 0 top
ENABLE-UHF  TEST-POINT-LARGE  [1X01]  32.9,75.2 90 top
FIDUCIAL1  FIDUCIAL-1.0X2.0  [FIDUCIAL-1.0X2.0]  95,9 0 top
FIDUCIAL2  FIDUCIAL-1.0X2.0  [FIDUCIAL-1.0X2.0]  95,90 0 top
FIDUCIAL3  FIDUCIAL-1.0X2.0  [FIDUCIAL-1.0X2.0]  4.1,89.6 0 top
H-DPLY  TEST-POINT-LARGE-SQUARE  [1X01]  57.4,81.8 0 top
ILIM-OUT  TEST-POINT-LARGE  [1X01]  39.6,79.1 0 top
J5  ORESAT-DEBUG-CONNECTOR-ALL  [TE_2-1734592-0]  26.78,6.59 180 top
J6  J-SAMTEC-TFM-120-X1-XXX-D-RA  [J-SAMTEC-TFM-120-X1-XXX-D-RA]  49.9,87.89 0 top
JP1  [2X06]  81.3,8.1 0 top
JP2  [2X06]  51,14.1 0 top
JP3  [2X04]  40.2,26.6 270 top
L1  15n  [.0402-C-NOSILK]  82.5,42 90 top
L2  6.8u  [ECS-MPI4040]  26,73.8 270 top
L3  15n  [.0402-C-NOSILK]  82.5,43.8 90 top
L4  3.9n  [.0402-C-NOSILK]  51.39,24.86 270 top
L5  18n  [.0402-C-NOSILK]  51.35,31 90 top
L6  43n  [.0402-C-NOSILK]  55.5,28.5 270 top
L7  43n  [.0402-C-NOSILK]  54.25,27.1 0 top
L8  91n  [.0603-C-NOSILK]  57.06,28.06 0 top
L10  43n  [.0402-C-NOSILK]  77.9,25.1 270 top
L11  43n  [.0402-C-NOSILK]  76.65,23.7 0 top
L12  91n  [.0603-C-NOSILK]  79.5,24.65 0 top
L13  91n  [.0603-C-NOSILK]  72.9,24.1 0 top
L14  18n  [.0402-C-NOSILK]  52,47.1 90 top
L16  10n  [.0603-C-NOSILK]  82.5,56 90 top
L17  6.8u  [ECS-MPI4040]  68.9,17 270 top
L18  22n  [.0603-C-NOSILK]  54.1,59.5 180 top
L19  22n  [.0603-C-NOSILK]  54.1,64.4 0 top
L20  0.047u  [.0603-C-NOSILK]  67.9,71.5 270 top
L21  2.0n  [.0402-C-NOSILK]  69.4,72.2 180 top
L22  10n  [.0603-C-NOSILK]  63,72.5 90 top
L23  91n  [.0603-C-NOSILK]  92.4,58.5 180 top
L24  91n  [.0603-C-NOSILK]  91.4,53.9 0 top
L25  4.1n  [.0402-C-NOSILK]  82.5,48.1 90 top
L26  5.6n  [.0402-C-NOSILK]  94.35,67.05 180 top
L27  68n  [.0402-C-NOSILK]  93.1,64.9 270 top
L28  5.6n  [.0402-C-NOSILK]  91.85,64.45 0 top
L29  5.6n  [.0402-C-NOSILK]  93.41,47.59 180 top
L30  68n  [.0402-C-NOSILK]  92.11,45.44 270 top
L31  5.6n  [.0402-C-NOSILK]  90.81,44.99 0 top
L32  22n  [.0805-C-NOSILK]  80.4,55.3 180 top
L38  15n  [.0402-C-NOSILK]  55.1,36 270 top
L39  15n  [.0402-C-NOSILK]  55.1,34.2 270 top
NRST  TEST-POINT-LARGE  [1X01]  27,10.4 0 top
OPD-ENABLE  TEST-POINT-LARGE  [1X01]  27.9,85.7 180 top
OPD-FAULT  TEST-POINT-LARGE  [1X01]  34.8,87.4 90 top
OPD-ISET  TEST-POINT-LARGE  [1X01]  30.2,84.1 180 top
PA1  TEST-POINT-LARGE  [1X01]  7.4,35.5 0 top
PA15  TEST-POINT-LARGE  [1X01]  28.5,50.7 0 top
PCB1  ORESAT-CARD-V1.3-GENERIC-3RF  [ORESAT-CARD-V1.3-GENERIC-3RF]  0,0 0 top
PG  TEST-POINT-LARGE  [1X01]  26,70.8 0 top
PG-U  TEST-POINT-LARGE  [1X01]  65.4,15.5 180 top
Q1  MOSFET-PCH-SOT23-6  [SOT23-6']  21.3,13.1 0 top
Q2  NTR4101  [SOT23-3]  37.6,45.7 270 top
Q4  NTR4101  [SOT23-3]  73.7,57.2 270 top
Q5  PM45EN  [SOT23-3]  71,59.5 270 top
Q6  DMP2240UDM-7  [SOT23-6']  38.9,69.1 90 top
Q7  BFPXXXF  [TSFP4]  65.6,72.7 90 top
Q8  DMP2240UDM-7  [SOT23-6']  38.9,64.1 90 top
Q9  BFPXXXF  [TSFP4]  92.6,56.2 180 top
Q10  NTR4101  [SOT23-3]  85.7,57 270 top
Q11  FDMQ86530L  [FDMQ8203]  39.2,58.4 0 top
Q12  DMP2240UDM-7  [SOT23-6']  45.5,69.1 90 top
Q13  DMP2240UDM-7  [SOT23-6']  45.5,64.1 90 top
Q14  FDMQ86530L  [FDMQ8203]  46,58.4 0 top
R1  2.7k  [.0603-C-NOSILK]  34.6,78.3 90 top
R2  2.7k  [.0603-C-NOSILK]  22.9,70 90 top
R3  10k  [.0603-C-NOSILK]  39.8,66.6 0 top
R4  2.7k  [.0603-C-NOSILK]  32.7,91.5 0 top
R5  31.6k  [.0603-C-NOSILK]  49.4,82.1 90 top
R6  3k  [.0603-C-NOSILK]  41.2,77.7 180 top
R7  10k  [.0603-C-NOSILK]  31,80.6 270 top
R8  10k  [.0603-C-NOSILK]  21.7,90.9 270 top
R9  10k  [.0603-C-NOSILK]  49.4,79.7 90 top
R10  NP  [.0603-C-NOSILK]  29,81.8 0 top
R11  10k  [.0603-C-NOSILK]  25.5,90.9 270 top
R12  10k  [.0603-C-NOSILK]  34,40 90 top
R13  100k  [.0603-C-NOSILK]  90.5,23.5 270 top
R14  10k  [ARRAY_EXBA-M]  10.26,27.82 90 top
R15  10k  [ARRAY_EXBA-M]  18.57,27.82 90 top
R16  10k  [.0603-C-NOSILK]  34.8,89.4 90 top
R17  10k  [.0603-C-NOSILK]  17.1,54.9 270 top
R18  10  [.0603-C-NOSILK]  22.9,90.9 90 top
R19  10k  [.0603-C-NOSILK]  36.5,61.6 0 top
R20  10k  [.0603-C-NOSILK]  38.9,77.7 180 top
R21  2.7k  [.0603-C-NOSILK]  92.4,21.1 270 top
R22  10k  [.0603-C-NOSILK]  46.4,66.6 0 top
R23  10  [.0603-C-NOSILK]  24.3,90.9 90 top
R24  10k  [.0603-C-NOSILK]  34,85.2 0 top
R25  100k  [.0603-C-NOSILK]  17.1,80 0 top
R26  47k  [.0603-C-NOSILK]  47.1,30.3 270 top
R27  10k  [.0603-C-NOSILK]  27.2,87.4 180 top
R28  47k  [.0603-C-NOSILK]  44.1,30.3 270 top
R29  47k  [.0603-C-NOSILK]  45.6,30.3 270 top
R30  47k  [.0603-C-NOSILK]  49.4,19.9 0 top
R31  150  [.0402-C-NOSILK]  58,23.1 90 top
R32  3k  [.0603-C-NOSILK]  6.8,82.1 90 top
R33  1k  [.0603-C-NOSILK]  40.6,71.9 180 top
R34  0  [.0402-C-NOSILK]  90,76.7 0 top
R35  100k  [.0603-C-NOSILK]  62.2,32.8 0 top
R36  23.7k  [.0603-C-NOSILK]  31.7,85.2 0 top
R37  100k  [.0603-C-NOSILK]  63.5,50.8 270 top
R38  150  [.0402-C-NOSILK]  80.4,19.6 90 top
R39  1k  [.0603-C-NOSILK]  47.2,71.9 180 top
R40  10k  [.0603-C-NOSILK]  39.6,73.4 180 top
R41  100k  [.0603-C-NOSILK]  87,28.1 180 top
R42  100k  [.0603-C-NOSILK]  87.6,11.6 180 top
R43  10k  [.0603-C-NOSILK]  13.1,76.4 90 top
R44  10k  [.0603-C-NOSILK]  43.3,61.6 0 top
R45  10k  [.0603-C-NOSILK]  46.2,73.4 180 top
R46  22k  [.0603-C-NOSILK]  56.25,61.8 90 top
R47  27  [.0603-C-NOSILK]  62.95,70.13 270 top
R48  45.3k  [.0603-C-NOSILK]  66.2,69.7 180 top
R49  15  [.0603-C-NOSILK]  61.81,67.87 0 top
R50  220  [.0603-C-NOSILK]  58.8,72.5 90 top
R51  0  [.0402-C-NOSILK]  55.1,37.8 270 top
R52  5.6k  [.0603-C-NOSILK]  86,69.7 180 top
R53  6.8k  [.0603-C-NOSILK]  86,70.9 0 top
R54  6.8k  [.0603-C-NOSILK]  83.7,73.3 0 top
R55  5.6k  [.0603-C-NOSILK]  83.7,72.1 180 top
R56  0  [.0402-C-NOSILK]  53.4,52.5 270 top
R57  39  [.0603-C-NOSILK]  89.1,53.9 180 top
R58  22k  [.0603-C-NOSILK]  90.1,58.5 180 top
R59  27  [.0603-C-NOSILK]  87.4,55 90 top
R60  0  [.0402-C-NOSILK]  56.6,73.2 180 top
R61  0  [.0402-C-NOSILK]  53.4,67.7 270 top
R62  0  [.0402-C-NOSILK]  55.1,32.2 270 top
R63  47k  [.0603-C-NOSILK]  8.2,85.1 270 top
R64  1k  [.0603-C-NOSILK]  33.5,65.4 180 top
R65  10k  [.0603-C-NOSILK]  32.8,63.7 270 top
R66  0  [.0402-C-NOSILK]  93.1,62.6 270 top
R67  NP  [.0603-C-NOSILK]  67.1,8.1 180 top
R68  10k  [.0603-C-NOSILK]  64.8,8.1 180 top
R69  0  [.0402-C-NOSILK]  92.1,49.6 270 top
R70  0  [.0402-C-NOSILK]  78.5,29 225 top
R71  15k  [.0603-C-NOSILK]  43.9,73.4 180 top
R73  1k  [.0603-C-NOSILK]  15,85.5 90 top
R74  10  [1206-C]  20.6,82.8 180 top
R75  2.7k  [.0603-C-NOSILK]  9.7,74.1 0 top
R76  10k  [.0603-C-NOSILK]  6.8,86.7 90 top
R77  10k  [.0603-C-NOSILK]  6.8,84.4 90 top
R78  3k  [.0603-C-NOSILK]  6.8,79.8 90 top
R79  15k  [.0603-C-NOSILK]  37.3,73.4 180 top
R80  10k  [.0603-C-NOSILK]  40.4,61.6 180 top
R81  10k  [.0603-C-NOSILK]  47.1,61.6 180 top
R82  10k  [.0603-C-NOSILK]  38.7,80.5 180 top
R83  10k  [.0603-C-NOSILK]  29.5,65.3 180 top
R84  10k  [.0603-C-NOSILK]  15.6,32.6 270 top
R85  150  [.0603-C-NOSILK]  74.7,44.1 270 top
R86  47k  [.0603-C-NOSILK]  72.4,40.2 90 top
R87  100k  [.0603-C-NOSILK]  75.9,43.4 270 top
R88  47k  [.0603-C-NOSILK]  73.6,37.9 90 top
R89  22k  [.0603-C-NOSILK]  73.6,40.2 90 top
R90  100k  [.0603-C-NOSILK]  80.1,44.8 90 top
R91  15k  [.0603-C-NOSILK]  80.1,42.5 90 top
R92  10k  [.0603-C-NOSILK]  34,37.6 270 top
R93  5.6k  [.0603-C-NOSILK]  75.9,58.6 180 top
R94  50  [.0402-C-NOSILK]  72.8,61.85 0 top
R95  50  [.0402-C-NOSILK]  84.7,65.4 270 top
R96  0  [.0603-C-NOSILK]  77.3,66 90 top
R97  0  [.0603-C-NOSILK]  88.5,68 90 top
R98  10k  [.0603-C-NOSILK]  36.5,42.7 270 top
R99  47k  [.0603-C-NOSILK]  71.1,56.5 90 top
R100  47k  [.0603-C-NOSILK]  70,62.5 270 top
R101  150  [.0603-C-NOSILK]  39.9,44.3 0 top
R102  10k  [.0603-C-NOSILK]  39.9,46 90 top
R103  NP  [.0603-C-NOSILK]  37.8,84.6 270 top
R104  470k  [.0603-C-NOSILK]  18.7,91 180 top
R105  10k  [.0603-C-NOSILK]  74.7,48.5 180 top
R106  10k  [.0603-C-NOSILK]  70.1,53.2 180 top
R107  10k  [.0603-C-NOSILK]  22.6,17 90 top
R108  10k  [.0603-C-NOSILK]  77.8,36.7 0 top
R109  100k  [.0603-C-NOSILK]  18.7,89.8 180 top
R110  100k  [.0603-C-NOSILK]  9.3,89.6 270 top
R111  100k  [.0603-C-NOSILK]  8.1,89.6 270 top
R112  1k  [.0603-C-NOSILK]  15,83.3 270 top
R113  10k  [.0603-C-NOSILK]  6.8,89 90 top
R114  10k  [.0603-C-NOSILK]  11.7,79 90 top
RT1  10K-NTC  [.0603-C-NOSILK]  78.4,48.2 180 top
SDIO-CK  TEST-POINT-LARGE  [1X01]  6.1,15.5 0 top
SPARE3  TEST-POINT-LARGE-SQUARE  [1X01]  59.4,82.6 0 top
SPARE4  TEST-POINT-LARGE-SQUARE  [1X01]  60.7,83.8 0 top
SPARE5  TEST-POINT-LARGE-SQUARE  [1X01]  62,84.9 0 top
SYNC  TEST-POINT-LARGE  [1X01]  32.7,81.1 0 top
SYNC-U  TEST-POINT-LARGE  [1X01]  66.4,6.7 180 top
T-DPLY  TEST-POINT-LARGE-SQUARE  [1X01]  55.1,84 0 top
TP1  TEST-POINT-LARGE-SQUARE  [1X01]  70.5,48.9 0 top
TP2  TEST-POINT_SMD-SMD-10SN  [TESTPOINT_SMD-10SN]  89.1,78.3 0 top
TP3  TEST-POINT-LARGE  [1X01]  88.2,57 0 top
TP4  [NO-CONNECT-FOOTPRINT]  0,0 0 top
TP5  TEST-POINT_SMD-SMD-10SN  [TESTPOINT_SMD-10SN]  91.5,62.6 0 top
TP6  TEST-POINT-LARGE-SQUARE  [1X01]  72.1,43 0 top
TP7  TEST-POINT_SMD-SMD-10SN  [TESTPOINT_SMD-10SN]  80.6,28 0 top
TP8  [NO-CONNECT-FOOTPRINT]  0,0 0 top
TP9  TEST-PAD-SMD-CIRCLE  [TESTPOINT_SMD-CIRCLE-1MM]  51.2,21.7 0 top
TP10  TEST-POINT-LARGE-SQUARE  [1X01]  75.7,69.3 0 top
TP11  TEST-PAD-SMD-CIRCLE  [TESTPOINT_SMD-CIRCLE-1MM]  51.35,35.6 0 top
TP12  TEST-POINT_SMD-SMD-10SN  [TESTPOINT_SMD-10SN]  56.8,32.3 0 top
TP13  [NO-CONNECT-FOOTPRINT]  0,0 0 top
TP14  TEST-POINT_SMD-SMD-10SN  [TESTPOINT_SMD-10SN]  51.8,67.8 0 top
TP15  TEST-POINT-LARGE-SQUARE  [1X01]  27.1,91.3 0 top
TP16  TEST-POINT-LARGE-SQUARE  [1X01]  32.7,40.4 0 top
TP17  TEST-POINT_SMD-SMD-10SN  [TESTPOINT_SMD-10SN]  57,38 0 top
TP18  TEST-POINT_SMD-SMD-10SN  [TESTPOINT_SMD-10SN]  51.7,52.4 0 top
TP19  [NO-CONNECT-FOOTPRINT]  0,0 0 top
TP20  TEST-POINT_SMD-SMD-10SN  [TESTPOINT_SMD-10SN]  55.8,71 0 top
TP21  [NO-CONNECT-FOOTPRINT]  0,0 0 top
TP22  [NO-CONNECT-FOOTPRINT]  0,0 0 top
TP23  TEST-POINT-LARGE-SQUARE  [1X01]  34.6,43.4 0 top
TP24  TEST-POINT-LARGE-SQUARE  [1X01]  33.6,42.4 0 top
TP25  TEST-POINT-LARGE-SQUARE  [1X01]  8.2,87.3 270 top
TP26  TEST-POINT-LARGE-SQUARE  [1X01]  15,87.4 0 top
TP27  TEST-POINT-LARGE-SQUARE  [1X01]  16.55,81.5 0 top
TP28  TEST-POINT_SMD-SMD-10SN  [TESTPOINT_SMD-10SN]  82,68.5 0 top
TP29  TEST-POINT-LARGE-SQUARE  [1X01]  38.1,13 0 top
U1  MAX892LEUA+T21-0036K-L  [21-0036K-L]  31.2,87.7 0 top
U2  TCAN330  [SOT23-8_TI-DCN]  34.3,52.4 180 top
U3  TCAN330  [SOT23-8_TI-DCN]  20.1,55.6 180 top
U4  TPS259621  [SO-POWERPAD-8]  44.6,80.8 90 top
U5  TPS62111RSA  [S-PVQFN-16]  27.3,78.6 180 top
U6  LP2985AIM5-2.5_NOPB  [SOT-23]  61.5,52.8 90 top
U7  TLV1704AMPWPSEP  [SOP65P640X120-14N]  11.7,84.4 90 top
U8  QPC1022  [QPC1022]  85.28,76.7 270 top
U9  SFEM016GB1EM1TO-A-HG-111-STD  [BGA-153(11.5X13)(EMMC-BA)]  13.1,17.2 0 top
U10  SI4112  [QFN28-5X5-WITH-CENTER-PAD]  47.42,24.11 0 top
U11  U-ONSEMI-AX5043  [QFN28-5X5-WITH-CENTER-PAD']  54.8,21.6 270 top
U12  LP2985AIM5-1.8_NOPB  [SOT-23]  62.7,29.6 270 top
U13  U-ONSEMI-AX5043  [QFN28-5X5-WITH-CENTER-PAD']  77.2,18.2 270 top
U14  LP2985AIM5-1.8_NOPB  [SOT-23]  87.3,22.8 180 top
U15  Qorvo 856930  [3.8X3.8]  55.1,41.5 270 top
U16  MAC-24+  [MAC-24+]  48.8,40.1 180 top
U17  BP0805A1308  [BP0805]  78.5,82.7 0 top
U19  BP0805A1308  [BP0805]  54,70.3 0 top
U20  BGB741L7ESD  [BGB7XXL7ESD]  53.9,61.8 180 top
U21  BP0805A1308  [BP0805]  54,54.7 0.2 top
U22  TLV7041DCKRYC5  [SC70-5]  78,44.8 270 top
U23  LP2985AIM5-2.5_NOPB  [SOT-23]  89.5,30.1 0 top
U24  MAX941EUA+  [21-0036K_MXM]  77.8,39.2 0 top
U25  SN74LVC1G32QDBVRQ1  [DBV5]  85.8,60.7 270 top
U26  TPS62112  [S-PVQFN-16]  67.4,12.1 0 top
U27  TPS259620  [SO-POWERPAD-8]  32.2,70.3 180 top
U28  LP2985AIM5-3.3_NOPB  [SOT-23]  87.3,15.3 90 top
U29  SN74LVC1G11IDCKRQ1  [DCK6]  73.2,50.9 90 top
U30  TQP7M9105  [U-QORVO-TQP7M9105-PA_TQP7M9105]  82.6,51.3 90 top
U31  BDCN-20-13+  [BDCN-20-13+]  81.5,62.9 90 top
U32  LT5534  [SC70]  75,64.6 90 top
U33  LT5534  [SC70]  88.6,65.6 90 top
U34  Micro Crystal RV-3028-C7  [RV3028C732768KHZ1PPMTAQC]  35.9,39.7 270 top
U35  FM24CL64B-DGTR  [TDFN-8]  39.3,51.4 270 top
U36  STM32F439VIT6_PORT_BREAKOUT  [QFP50P1600X1600X160-100N]  20.1,43.5 0 top
U$1  FLIGHMARKERNEW  [FLIGHTMARKER_NEW_BOARDS]  54,3.5 0 top
UHF_ILIM  TEST-POINT-LARGE  [1X01]  31.3,63.4 90 top
VBUS  TEST-POINT-LARGE  [1X01]  48.7,85 0 top
VBUSP  TEST-POINT-LARGE  [1X01]  41.7,83.7 0 top
VBUSP-OUT-U  TEST-POINT-LARGE  [1X01]  6.7,67.1 0 top
WDT  TEST-POINT-LARGE  [1X01]  11.7,74.1 0 top
X1  ECS-160-10-36Q-ES-TR_16MHZ  [2.5X2.0]  9.5,42.7 270 top
X2  ABS07-120-32.768KHZ-T  [ABS07-32.768KHZ-T]  9.7,48.4 270 top
X3  TAITIEN-TY  [2.5X2.0]  60.7,26 180 top
X4  TAITIEN-TY  [2.5X2.0]  83.1,22.5 180 top

## Tracks (layer width: path | path; a pad name or v marks a point on that pad's centre or on a via)
1.8V-U
  pour Top (isolate 0.2, no thermals): 83.3,20.4 87.3,20.4 87.3,22.3 83.3,22.3
1V8
  Top 0.6: U12.5 63.65,24.35 C50.1
  pour Top (isolate 0.2, no thermals): 60.8,23.8 64.3,23.8 64.3,25.8 60.8,25.8
2.5V-L  (via drill 0.25)
  Top 0.2: 2.5V-L.1 v59.73,53.8
  Top 0.25: U20.5 53.9,60.62 54.33,60.19 54.89,60.19 54.9,60.2 54.9,59.6 L18.1
  Top 0.305: v59.73,53.8 v59.74,53.79
  Top 0.4: C27.1 60.55,56.33 U6.5
  Top 0.6: v62.51,68.7 R49.2 v63.21,67.87 v63.91,67.87
  other vias: 56.73,60.09 55.5,59.4 55.2,62.8 54.6,63.4 59.75,54.49 59.75,55.16 55.9,60.1 56.3,59.4 56.2,63.4
  pour Top (isolate 0.2, no thermals): 61.05,53.38 61.05,56.94 60.01,56.94 60.02,55.54 59.35,55.54 59.35,53.38
  pour Top (isolate 0.2, no thermals): 54.6,59.1 58.1,59.1 58.1,63.6 54.4,63.6 54.4,62.6 55.9,62.6 55.9,62.3 57,62.3 57,60.3 54.6,60.3
  pour VPLANE (isolate 0.2, rank 3): 54,73.1 67.46,73.1 68,73.08 68,68.4 63,63.4 63,53 54,53
2.5V-U  (via drill 0.25)
  VPLANE 0.5: v94.3,53.9 v94.8,53.9 v95.3,53.9 95.6,53.6 v95.6,35.6 v95.2,35.2 v94.8,34.8
  Bottom 0.5: v95.6,35.6 91.8,31.8 v90.6,31.8 | v95.3,53.9 88.84,53.9 87.54,55.2 v85.4,55.2 v84.9,55.2 v84.4,55.2
  other vias: 91.1,31.8 91.6,31.8 93.4,33.4 92.6,32.6
  pour Top (isolate 0.2, no thermals): 90,30.7 93.7,30.7 93.7,33.91 90,33.89
  pour Top (isolate 0.2, no thermals): 84.11,56.76 84.11,55.01 85.73,55.01 85.73,56.76
3.3V  (via drill 0.25)
  Top 0.25: U10.24 47.92,30.28 R26.1 | U3.3 19.77,58.27 C6.2 | R82.2 v37.2,80.5 | 24.4,73.78 L2.2
  Top 0.3: C34.1 14.4,32.8 14.6,32.6 15.3,32.6 15.6,32.3 R84.2 | 24.4,73.78 3.3V.1 R2.2
  Top 0.305: J5.11 26.53,7.43 v26.4,7.3 | U10.17 v50.39,23.61 v50.4,23.6 | U36.6 v13.8,47 | v13.8,44.3 13.6,44.5 U36.11 11.5,44.5 10.6,45.4 C36.1 | U36.50 26.34,35.76 v27.3,34.8 C35.1 | U2.3 33.98,55.23 C17.2 | v34.7,54.9 34.3,55.3 C17.2 | U36.19 11.3,40.5 v11.1,40.3 | U36.22 11.3,39 v11.1,38.8 | U36.75 v29,49.5 29.2,49.7 C18.1 | U10.11 C37.1 | v34.8,90.8 R16.2 | C6.2 v20.7,58.7 | C17.2 33.7,55.4 v33.7,56.2 | v13.2,52.7 C32.1 U36.100 14.04,51.3 v13.2,51.3 | U36.21 v11.1,39.5 | R83.2 v28.1,65.3 | v13.5,33.3 C34.1 14.4,33.8 v15,34.4 15.1,34.5 U36.28
  Top 0.35: U11.23 57.8,20.6 v57.9,20.5
  Top 0.4: v36.5,45.6 36.5,44.85 Q2.2 | v35.7,44.7 35.75,44.75 Q2.2 | v37.5,44.7 37.45,44.75 Q2.2
  other vias: 23,13.3 23,15.6 23,14.4 22.2,15.6 22.2,13.3 51.4,23.6 50.9,23.6 47.3,19 47.9,19 48.5,19 61.3,20.4 60.1,20.4 58.9,20.4 64.1,33.1 64.1,32.5 63.7,31.9 62.5,49.4 61.9,49.4 61.3,49.4 63.2,49.4 63.8,49.4 64.1,33.7 44.1,32.1 44.7,32.1 45.3,32.1 45.9,32.1 46.5,32.1 10.4,36.1 9.7,37.7 9.7,39.2 47.1,32.1 47.7,32.1 48.3,32.1 18.9,60 24.2,78 24.2,77.3 24.2,76.6 24.2,75.9 24.2,75.2 27.1,88.4 28.1,88.4 27.6,88.4
  pour Top (isolate 0.2, no thermals): 21.95,13 21.95,16.7 23.3,16.7 23.3,13
  pour Top (isolate 0.2, no thermals): 46.9,20.63 46.9,18.7 49.11,18.7 49.11,20.63
  pour VPLANE (isolate 0.2, rank 5): 95.3,5 12,5 5,12 5,91.2 6,92.2 34.3,92.2 35.3,91.2 35.3,84.1 38.2,81.2 38.2,64.7 95.3,64.7
  pour Top (isolate 0.2, rank 3, no thermals): 62,50.8 64.2,50.8 64.2,48.7 59.6,48.7 59.6,52.4 61,52.4 61,50 62,50
  pour Top (isolate 0.2, rank 4, no thermals): 63.4,31.6 63.4,30.3 64.4,30.3 64.4,34.5 62.7,34.5 62.7,32.3
  pour Top (isolate 0.2, rank 3, no thermals): 50.1,23.9 50.1,23.3 51.8,23.3 51.8,23.9
  pour VPLANE (isolate 0.2, rank 3, no thermals): 64.9,50.1 60,50.1 60,26 64.9,26
  pour Top (isolate 0.2, no thermals): 61.9,20.7 57.6,20.7 57.6,20.1 58.3,19.4 61.9,19.4
  pour Top (isolate 0.2, no thermals): 43.5,30.6 43.5,33.8 49.3,33.8 49.3,32.3 47.6,30.6
  pour Top (isolate 0.2, no thermals): 11.4,40.6 9.4,40.6 9.4,35.8 10.9,35.8 10.9,38 11.4,38.5
  pour Top (isolate 0.2, rank 4, no thermals): 25.2,72.8 23.2,72.8 23.2,79.4 24.7,79.4 24.7,79.2 25.8,79.2 25.8,78.7 24.7,78.7 24.7,75 25.2,75
  pour Top (isolate 0.2, rank 5, no thermals): 29.6,87 29.6,89.2 29.1,89.7 27.2,89.7 27.2,89 26.2,88 26.2,87
3.3V-U  (via drill 0.25)
  Top 0.2: C97.1 86.4,74.5 85.67,75.22 U8.7
  Top 0.25: R52.1 v87.4,69.7 C138.1 C137.1 | U24.4 76.44,38.23 76.8,38.58 76.8,40.2 75.61,40.2 U24.1
  Top 0.28: C137.1 87.4,66.8 87.7,66.5 U33.4
  Top 0.3: U13.23 80.2,17.2 v80.3,17.1 | 3.3V-U.1 v92.7,22.8 | R41.2 86,28.1 85.6,28.5 85.6,29.7 | U29.5 73.2,51.1 73.4,50.9 v73.6,50.9 v74.2,50.9 74.8,50.9 75,51.1 C121.1 | v88.6,66.25 U33.4
  other vias: 85.6,31.3 85.6,30.8 92.1,22.8 89.6,21.6 89.6,22.8 89.6,22.2 85.6,31.8 81.1,17 82.3,17 83.5,17 80.3,16.6 91.5,22.8 85.6,16.6 87.1,16.6 73.5,66.5 73.5,65.9 86.1,74.5 86.1,73.3 86.1,73.9 88.2,59.3 87.6,59.3 79.8,47 79.8,46.5 72.4,41.7 73.6,41.6 76.5,41.7 74.5,40.2
  pour Top (isolate 0.2, rank 3, no thermals): 86.3,30.8 86.3,29.6 85,29.6 85,32.2 88.7,32.2 88.7,30.8
  pour Top (isolate 0.2, rank 3, no thermals): 85.3,16 85.3,16.3 88,19 88,23.1 93.2,23.1 93.2,21.1 89.7,21.1 89.7,18.5 87.2,16
  pour Top (isolate 0.2, no thermals): 86.1,17.2 80.5,17.2 80.4,17.3 80,17.3 80,16.5 80.5,16 86.1,16
  pour Top (isolate 0.2, rank 3, no thermals): 74.7,65.1 73.2,65.1 73.2,68.1 74.7,68.1
  pour VPLANE (isolate 0.2, rank 3): 81.1,75.9 71,65.8 71,19.1 73.7,16.4 77.1,16.4 77.1,18.3 79,18.3 79,16 95.3,16 95.3,75.9
  pour Top (isolate 0.2, no thermals): 85.7,74.9 85.7,72.9 87.1,72.9 87.1,74.9
  pour Top (isolate 0.2, no thermals): 86.51,60.41 86.51,58.81 88.71,58.81 88.71,60.41
  pour Top (isolate 0.2, no thermals): 78.41,47.41 78.41,45.21 80.61,45.21 80.61,47.41
  pour Top (isolate 0.2, no thermals): 71.81,42.11 71.81,39.91 77.51,39.91 77.51,42.11
5V-U  (via drill 0.25)
  Top 0.25: 72.43,55.8 R99.1
  VPLANE 1: 85.9,13.8 73.6,13.8 v71.6,15.8 v71.6,16.4 v71.6,17 v71.6,17.6 66.6,22.6 66.6,50.1 71.3,54.8 v72.6,54.8
  other vias: 86.1,11.6 85.6,13.5 85.6,14.2 86.7,12.5 73.1,55.3 72.6,55.3 72.1,55.3 72.1,54.8 73.1,54.8
  pour Top (isolate 0.2, rank 4, no thermals): 85.3,11.2 85.3,14.6 86.7,14.6 86.7,12.9 87.1,12.5 87.1,11.2
  pour VPLANE (isolate 0.2, rank 4, no thermals): 87.1,11.2 87.1,12.7 86.7,12.7 86.7,14.6 85.3,14.6 85.3,11.2
  pour Top (isolate 0.2, rank 5, no thermals): 69.8,18 72,18 72,15.1 71.3,14.4 71.3,9.8 69.9,9.8 69.9,11.5 68.9,11.5 68.9,12.1 70,12.1 70,15.6 69.8,15.8
  pour Top (isolate 0.2, no thermals): 71.9,56.8 71.9,54.6 73.3,54.6 73.3,56.8
  pour VPLANE (isolate 0.2, no thermals): 71.7,55.7 71.7,54.1 73.3,54.1 73.3,55.7
!CB_FLT
  Top 0.25: U4.6 39.84,81.44 39.4,81 R82.1 39,80.5 38.7,80.2 38.7,79.6 38.2,79.1 !FLT.1
!LATCH_FEEDBACK
  Top 0.25: U24.5 80.01,37.21 79.5,36.7 R108.2 78.5,35.8 77.8,35.1 D14.C
!LNA_EN
  Top 0.25: U25.4 84.85,58
  Top 0.3: 84.85,58 Q10.1
!M4_LNA_ENABLE  (via drill 0.25)
  Top 0.25: U36.44 23.1,34.11 v23.31,33.9 | U25.2 v85.8,63 | v58.15,10 57.15,9 39.9,9 v38.1,10.8 | R106.2 v68.1,53.2
  Bottom 0.25: v23.31,33.9 23.51,33.7 23.51,22.19 34.9,10.8 v38.1,10.8 | v58.15,10 58.15,10.45 68.1,20.4 v68.1,53.2 68.1,59.1 69.5,60.5 83.3,60.5 v85.8,63
!M4_TOT_CLEAR  (via drill 0.25)
  Top 0.25: U36.46 v24.1,37.4 | v43.5,6.8 43.7,7 58.21,7 60.85,9.64 60.85,13.15 68.2,20.5 68.2,27.43 71.3,30.53 71.3,32.2 74.2,35.1 D14.A
  Bottom 0.25: v24.11,37.4 24.6,36.91 24.6,22.5 35.3,11.8 42.4,11.8 43.5,10.7 v43.5,6.8
  Bottom 0.305: v24.1,37.4 v24.11,37.4
!OPD_ENABLE  (via drill 0.25)
  Top 0.25: v22.5,55 22.5,53.88 21.1,52.48 U36.86 | v19.1,79.4 v20.4,78.1
  Top 0.305: U1.3 27.93,87.38 R27.1 OPD-ENABLE.1
  Bottom 0.25: OPD-ENABLE.1 24.93,85.7 19.1,79.87 v19.1,79.4 | v22.5,55 22.2,55.3 22.2,59.2 21.3,60.1 21.3,75.4 20.4,76.3 v20.4,78.1
!SD  (via drill 0.25)
  Top 0.3: R103.1 37.8,87.22 J6.40 | U7.13 10.4,90.6 12.4,92.6 12.7,92.6 | v12.7,92.9 12.7,92.6 | 12.7,92.6 v12.7,92.3
  Bottom 0.3: J6.40 J6.39 37.84,89.56 34.8,92.6 27.1,92.6 | TP15.1 27.1,92.6 | 27.1,92.6 12.7,92.6 | 12.7,92.6 v12.7,92.9 | 12.7,92.6 v12.7,92.3
!TOT_PA_DISABLE  (via drill 0.25)
  Top 0.25: U36.42 22.1,34.7 21.7,34.3 v20.9,34.3 | v36.6,10.2 37.6,10.2 39.3,8.5 57.4,8.5 59.5,10.6 59.5,13.9 66.7,21.1 66.7,27.9 69.7,30.9 v69.7,38.2 69.7,41.5 70,41.8 70,46.8 70.5,47.3 TP1.1 | U24.7 78.42,39.52 v77.1,38.2 R108.1
  Top 0.3: U29.1 72.43,49.8 71.4,49.8 TP1.1
  Bottom 0.25: v77.1,38.2 v69.7,38.2 | v20.9,34.3 21.17,34.03 21.17,33.09 23.08,31.18 23.08,21.92 34.8,10.2 v36.6,10.2
ANTN1
  Top 0.3: U11.4 54.8,24.4
  Top 0.38: C42.2 L7.2 arc-4 54.8,24.4
ANTN2
  Top 0.35: U13.4 77.2,20.95
  Top 0.38: 77.2,20.95 arc5 77.1,23.4 L11.2 C58.2
ANTP2
  Top 0.3: U11.3 55.3,24.4
  Top 0.35: L8.1 L6.2
  Top 0.38: L6.2 C43.2 arc8 55.3,24.4
ANTP4
  Top 0.35: U13.3 77.7,20.95
  Top 0.38: L12.1 L10.2 C59.2 77.9,23.4 arc9 77.7,20.95
ANTP5
  Top 0.35: 76.7,20.99 U13.5
  Top 0.38: 76.7,20.99 arc45 76.41,21.69 74.68,23.42 arc-45 74.5,23.86 C65.2 73.65,24.15 L13.2
B1
  Top 0.38: Q7.1 L20.1 L21.2
B2
  Top 0.38: Q9.1 L23.1 C105.2
BOOT0
  Top 0.25: R17.2 BOOT0.1 U36.94
C1
  Top 0.38: Q7.3 L22.2 C39.1
C2
  Top 0.38: Q9.3 L24.2 C102.1
C3-UART-RX  (via drill 0.25)
  Top 0.25: U36.56 26.9,40 26.6,39.7 | 26.03,28.17 J5.12 | 26.6,39.7 26.6,37.4 29.31,34.69 29.31,31.59 27.51,29.79 v27.51,28.19 | 26.6,39.7 26.6,43.6 27,44 U36.64 28.8,44 v29,44.2 | J6.38 39.1,85.59 39.4,85.3 v43,85.3
  Top 0.305: v26,28.2 26.03,28.17
  Bottom 0.25: 27.5,28.2 v26,28.2 | v43,85.3 48.7,79.6 48.7,72.7 46.6,70.6 46.6,56.6 42.7,52.7 39.9,52.7 31.4,44.2 v29,44.2
  Bottom 0.305: v27.51,28.19 27.5,28.2
C3-UART-TX  (via drill 0.25)
  Top 0.25: 25.4,26.5 25.4,21.02 25.53,20.89 J5.13 | U36.55 29,39.5 | 29,39.5 29.5,39.5 30.7,38.3 30.7,30.2 v27.7,27.2 | U36.63 v29,43.5 | v29,39.9 29,39.5
  Top 0.254: v25.4,27.2 25.4,26.5
  Bottom 0.25: v29,39.9 v29,43.5 31.3,43.5 40.1,52.3 42.9,52.3 47,56.4 47,70.47 49.08,72.54 49.08,74.88 53.3,79.1 61.4,79.1 64.6,82.3 64.6,88.8 62.3,91.1 39.9,91.1 39.1,90.31 J6.37
  Bottom 0.254: v27.7,27.2 v25.4,27.2
CAN1_H  (via drill 0.25)
  Top 0.305: v27.71,54.73 29.81,52.63 34.05,52.63 34.49,52.19 34.5,52.19 34.62,52.07 U2.7
  Bottom 0.25: J6.34 41.65,85.75 37.9,82 25.6,82 23.3,79.7 23.3,61.14 27.71,56.73 v27.71,54.73
  Bottom 0.4: J6.33 J6.34
CAN1_L  (via drill 0.25)
  Top 0.305: v27.2,54.12 29.12,52.2 33.7,52.2 33.98,51.92 U2.6
  Bottom 0.25: J6.36 40.38,85.67 37.1,82.4 25.47,82.4 22.9,79.83 22.9,60.72 27.2,56.42 v27.2,54.12
  Bottom 0.4: J6.35 J6.36
CAN1_RX  (via drill 0.25)
  Top 0.25: U2.4 v32.7,53.7 | v30.41,47 U36.70
  Top 0.305: v30.42,47.01 v30.41,47
  Bottom 0.25: v32.7,53.7 32.7,48.14 31.57,47.01 v30.42,47.01
CAN1_SHDN
  Top 0.25: U36.69 31.4,46.5 33.33,48.42 U2.5
CAN1_SILENT
  Top 0.25: U2.8 35.27,49.67 31.6,46 U36.68
CAN1_TX  (via drill 0.25)
  Top 0.25: U36.71 v29.19,47.5 | v35.3,52.7 35.3,53.67
  Top 0.305: v29.19,47.5 v29.2,47.51 | 35.3,53.67 U2.1
  Bottom 0.25: v29.2,47.51 30.51,46.2 32.1,46.2 35.3,49.41 v35.3,52.7
CAN2_H  (via drill 0.25)
  Top 0.25: U3.7 20.43,55.39 20.6,55.57 23.07,55.57 v23.3,55.8 | J6.17 51.8,89.89 50.5,91.2 36.8,91.2 36.1,90.5 36.1,86.2 v36.6,85.7
  Bottom 0.25: v36.6,85.7 36.6,85 34.4,82.8 25.33,82.8 23.12,80.58 23.07,80.53 22.3,79.77 22.3,60.7 23.3,59.7 v23.3,55.8
  Bottom 0.4: J6.17 J6.18
CAN2_L  (via drill 0.25)
  Top 0.25: U3.6 19.77,55.44 20.33,56 22.4,56 v22.7,56.3 | J6.19 50.53,90.06 49.8,90.8 37,90.8 36.6,90.4 v36.6,86.5
  Bottom 0.25: v36.6,86.5 36,85.9 36,85 34.2,83.2 25.2,83.2 22.85,80.85 22.8,80.8 21.92,79.92 21.92,60.54 22.7,59.77 v22.7,56.3
  Bottom 0.4: J6.19 J6.20
CAN2_RX
  Top 0.25: U36.91 18.6,55.3 19.12,55.83 U3.4
CAN2_SHDN
  Top 0.25: U36.90 19.1,54.27
  Top 0.305: 19.1,54.27 U3.5
CAN2_SILENT  (via drill 0.25)
  Top 0.25: U36.93 v17.6,50.1
  Top 0.305: U3.8 21.1,54.27 v21.1,53.3
  Bottom 0.25: v21.1,53.3 21.1,52.4 18.8,50.1 v17.6,50.1
CAN2_TX  (via drill 0.25)
  Top 0.25: v18.5,56.9 18.1,56.5 U36.92
  Top 0.305: v21.7,56.9 U3.1
  Bottom 0.25: v21.7,56.9 v18.5,56.9
CAPS1
  Top 0.6: C77.1 60.92,68.92 61.7,68.92 62.21,69.43 R47.2 63.83,69.43 64.1,69.7 R48.2
  pour Top (isolate 0.2, no thermals): 61.35,67.28 57.01,67.28 57.01,69.26 61.36,69.26
CAPS2
  Top 0.5: R58.2 89.4,55.9 88.4,54.9 R57.2
  pour Top (isolate 0.2, no thermals): 88.61,54.69 88.61,52.99 85.81,52.99 85.81,54.69
CAPS3
  Top 0.3: R93.2 75.2,57.17 75.18,57.2 Q4.3
  pour Top (isolate 0.2, no thermals): 80,54.6 80,57.2 79.5,57.7 74.1,57.7 74.1,55.5 79.1,55.5 79.1,54.6
CB_IOUT_IN  (via drill 0.25)
  Top 0.25: v16.4,43.4 14.5,41.5 U36.17 | R20.2 v37.5,77.7 | v26.7,62.5 26.6,62.4 v15.1,62.4
  Bottom 0.25: v16.4,43.4 15.6,44.2 15.6,56.69 15.3,56.99 15.3,62.2 v15.1,62.4 | v37.5,77.7 35.1,77.7 33.7,76.3 32.47,76.3 31.2,75.03 31.2,72.83 26.7,68.33 v26.7,62.5
CLKN1
  Top 0.25: U11.27 57.95,22.6 R31.1 58.8,22.65
  Top 0.305: 58.8,22.65 C44.1
CLKN2
  Top 0.25: U13.27 80.35,19.2 R38.1
  Top 0.305: R38.1 80.45,19.2 C60.1
CLKP1
  Top 0.305: C45.1 58.8,23.55 R31.2 57.3,23.55 57.05,23.3 U11.28
CLKP2
  Top 0.25: U13.28 79.45,19.9 79.6,20.05 R38.2 | 80.45,20.1 C61.1
  Top 0.305: R38.2 80.45,20.1
CTRL1
  Top 0.2: U8.5 84.88,75.58 84.4,75.1 C99.1
  Top 0.3: R55.1 R54.2 C99.1
DEBUG-0
  Top 0.25: J5.17 23.53,9.47
  Top 0.305: 23.53,9.47 DEBUG-0.TP
DEBUG-1
  Top 0.25: J5.18 23.03,10.37
  Top 0.305: 23.03,10.37 DEBUG-1.TP
DEBUG-2
  Top 0.25: 22.53,9.47 J5.19
  Top 0.305: DEBUG-2.TP 22.53,9.47
DEBUG-3
  Top 0.25: 22.03,10.37 J5.20
  Top 0.305: DEBUG-3.TP 22.03,10.37
DISABLE_LVL
  Top 0.25: U24.2 73.62,39.52 R89.1
  Top 0.3: R89.1 R88.2
EMMC_PWR
  Top 0.25: Q1.3 22.99,11.8 23.6,12.41 23.6,17.7 | 23.6,17.7 23.6,30 20.1,33.5 U36.38 | R107.2 23.6,17.7
EMMC_VDD  (via drill 0.25)
  Top 0.152: U9.N4 U9.P3 | U9.N4 U9.P5 | U9.C6 12.35,19.41 12.6,19.16 12.6,18.76 12.35,18.52 U9.E6 12.43,18.38 v12.43,17.93 12.4,17.95 U9.F5 | U9.K9 13.85,16.5 v13.66,16.69 13.9,16.45 U9.J10 14.61,16.45 v14.86,16.2 | U9.N4 U9.M4
  Top 0.25: v12.43,17.93 v13.66,16.69 | U9.P3 10.85,11.45 | U9.P5 11.85,13.05 12.4,12.5 v12.4,11.4 | U9.P7 12.86,13.49 14,12.34 v14,11.4 | v21.1,27.3 R15.5 v21.1,25.2 | v16,28.4 16,29.37 | 16,29.37 R15.10 | v16,30.4 16,29.37 | v12.8,27.3 R14.5 | R14.5 | v12.8,25.2 R14.5 | v7.7,28.3 7.7,29.38 | 7.7,29.38 R14.10 | v7.7,30.5 7.7,29.38
  Top 0.254: U9.P7
  Top 0.305: 10.85,11.45 v10.8,11.4
  other vias: 10.8,9.9 14,9.9 15.6,9.9 17.3,9.9 17.3,11.4 19.6,10.1 19.6,11.8 20.3,12.8 19.62,14.39 19.8,16.5 18.1,16.5 18.1,14.4 20.3,13.5 21.3,10.9 20.3,10.9 18.1,11.79 15.6,11.4 12.4,9.9
  pour Top (isolate 0.2, no thermals): 10.24,8.4 21.61,8.4 21.61,17.42 17.49,17.42 17.49,13.01 10.24,13.01
  pour VPLANE (isolate 0.2, no thermals): 21.66,8.39 11.55,8.39 7.05,12.89 7.05,30.7 21.66,30.7
EN1
  Top 0.2: C98.1 85.28,72.12 U8.6
  Top 0.25: R52.2 R53.1 C98.1
EN-UHF  (via drill 0.25)
  Top 0.25: U36.85 21.6,52.3 29.5,60.2 v29.5,60.7
  Top 0.305: U27.3 31.57,74.36 32.4,75.2 ENABLE-UHF.1
  Bottom 0.25: v29.5,60.7 29.5,70.4 32.9,73.8 ENABLE-UHF.1
EN/UVLO
  Top 0.305: U4.3 49.36,81.44 R5.1 R9.2
GND  (via drill 0.25)
  Top 0.152: U9.H10 14.58,16.95 v14.86,17.23 | U9.N5 U9.P6 | v12.67,16.67 11.89,17.45 U9.G5 11.5,17.8 11.5,18.7 11.35,18.85 U9.D4 U9.C4 | U9.E7 13.48,17.82 v13.82,17.82
  Top 0.25: U9.P4 11.35,12.75 v11.6,12.5 | 12.37,13.93 12.37,13.31 13.1,12.57 | 57.8,22.1 U11.26 | 15,52.5 14.6,52.1 U36.99 v14.6,50.1
  Top 0.254: U9.P6 12.37,13.93 | 13.1,12.57 v13.1,12.5
  Top 0.305: U14.2 v87.3,22.8 | J5.3 30.53,7.33 v30.5,7.3 | v29,7.3 29.03,7.33 J5.6 29.03,9.17 v29,9.2 | J5.9 27.53,7.33 v27.5,7.3 | U13.26 79.93,18.7 80.3,18.33 v80.3,18.3 80.2,18.2 U13.25 | v25.3,77 25.3,77.6 U5.12 U5.11 | v69.4,13.7 69.4,13.1 U26.12 U26.11 | v23.6,85.1 D11.2 | v23.6,89.7 D11.5 | U5.16 28.27,75.32 v28.3,75.29 | U5.1 30.07,77.62 v30.1,77.6 C10.2 v31,76.9 | C7.2 v32.2,76.9 | U26.1 64.67,13.07 v64.6,13 C88.2 | U26.16 66.4,14.1 v66.4,14.9 | U26.7 67.72,9.32 v67.7,9.3 | U26.6 67.08,9.3 v67.1,9.3 | U5.7 26.98,81.38 v27,81.4 | U5.6 27.62,81.38 v27.6,81.4 | U36.10 v13.8,45 | v8,45.4 C36.2 8.7,46 v8.4,46.3 | v6.6,46.3 C13.2 | v5.9,47.2 C13.2 | v6.6,48.1 C13.2 | C9.2 v6.6,48.7 | v5.9,49.6 C9.2 | v6.6,50.5 C9.2 | v6.1,44.8 C16.2 | v5.3,43.9 C16.2 | C16.2 v6.1,43 | v6.1,42.4 C11.2 | v5.4,41.5 C11.2 | C11.2 v6.1,40.6 | C115.2 v8.2,40 | v8.2,38.5 C33.2 | v8.2,37 C114.2 v8.9,36.1 | U36.20 v13.7,40 | v14.2,34.4 14.6,34.8 U36.27 | v25.2,32.2 C14.2 v26.1,31.5 | v27.3,31.5 C35.2 v28.2,32.2
  Top 0.36: U11.26 | U11.25 57.6,21.6 v57.9,21.3
  Top 0.4: C145.2 39.6,48.6 39.77,48.77 U35.7 39.77,50.92 U35.9
  Bottom 0.4: J6.30 J6.29 | J6.28 J6.27